# EasyEDA schematic SCH_PSG4-v0.52_2026-07-15.json

## Sheets
1 MCU_Port: TITLE: MCU_Port; REV: 1.0; Date: 2026-07-02; Sheet: 1/1; Drawn By: Denjhang; Company: Your Company
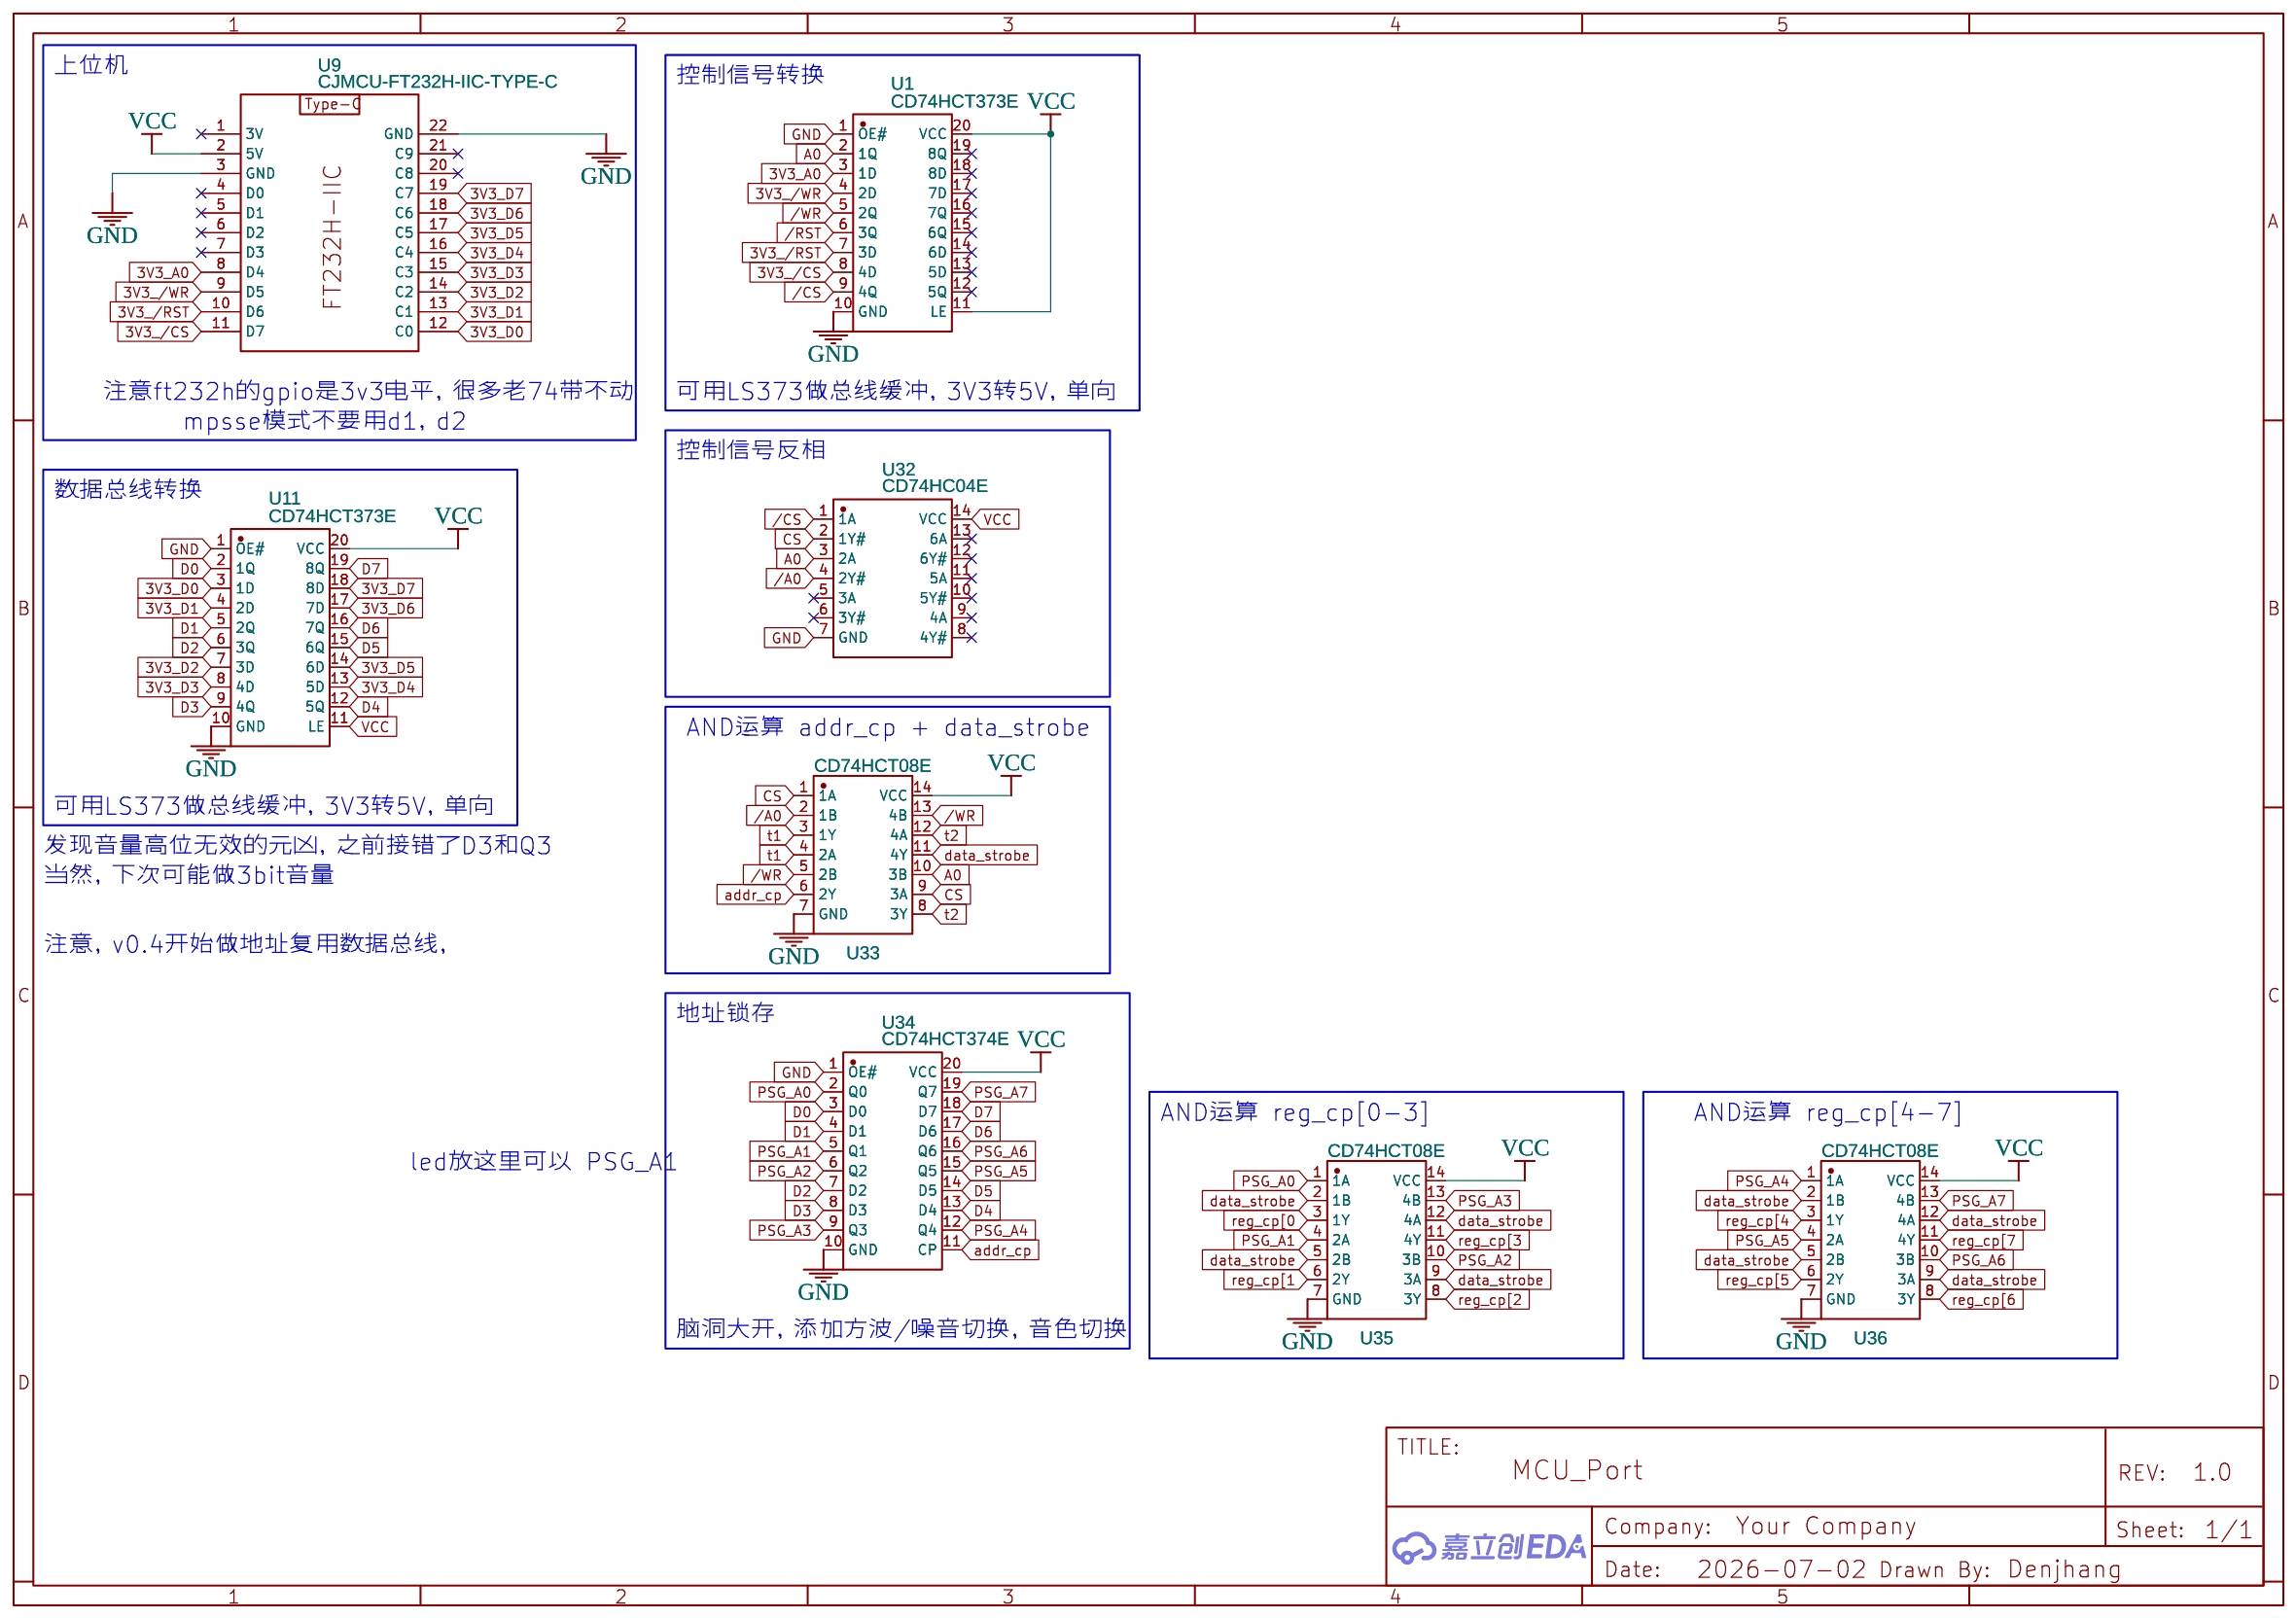
[diagram p0: MCU_Port]
2 Port_ADDR: TITLE: Port_ADDR; Date: 2026-07-09
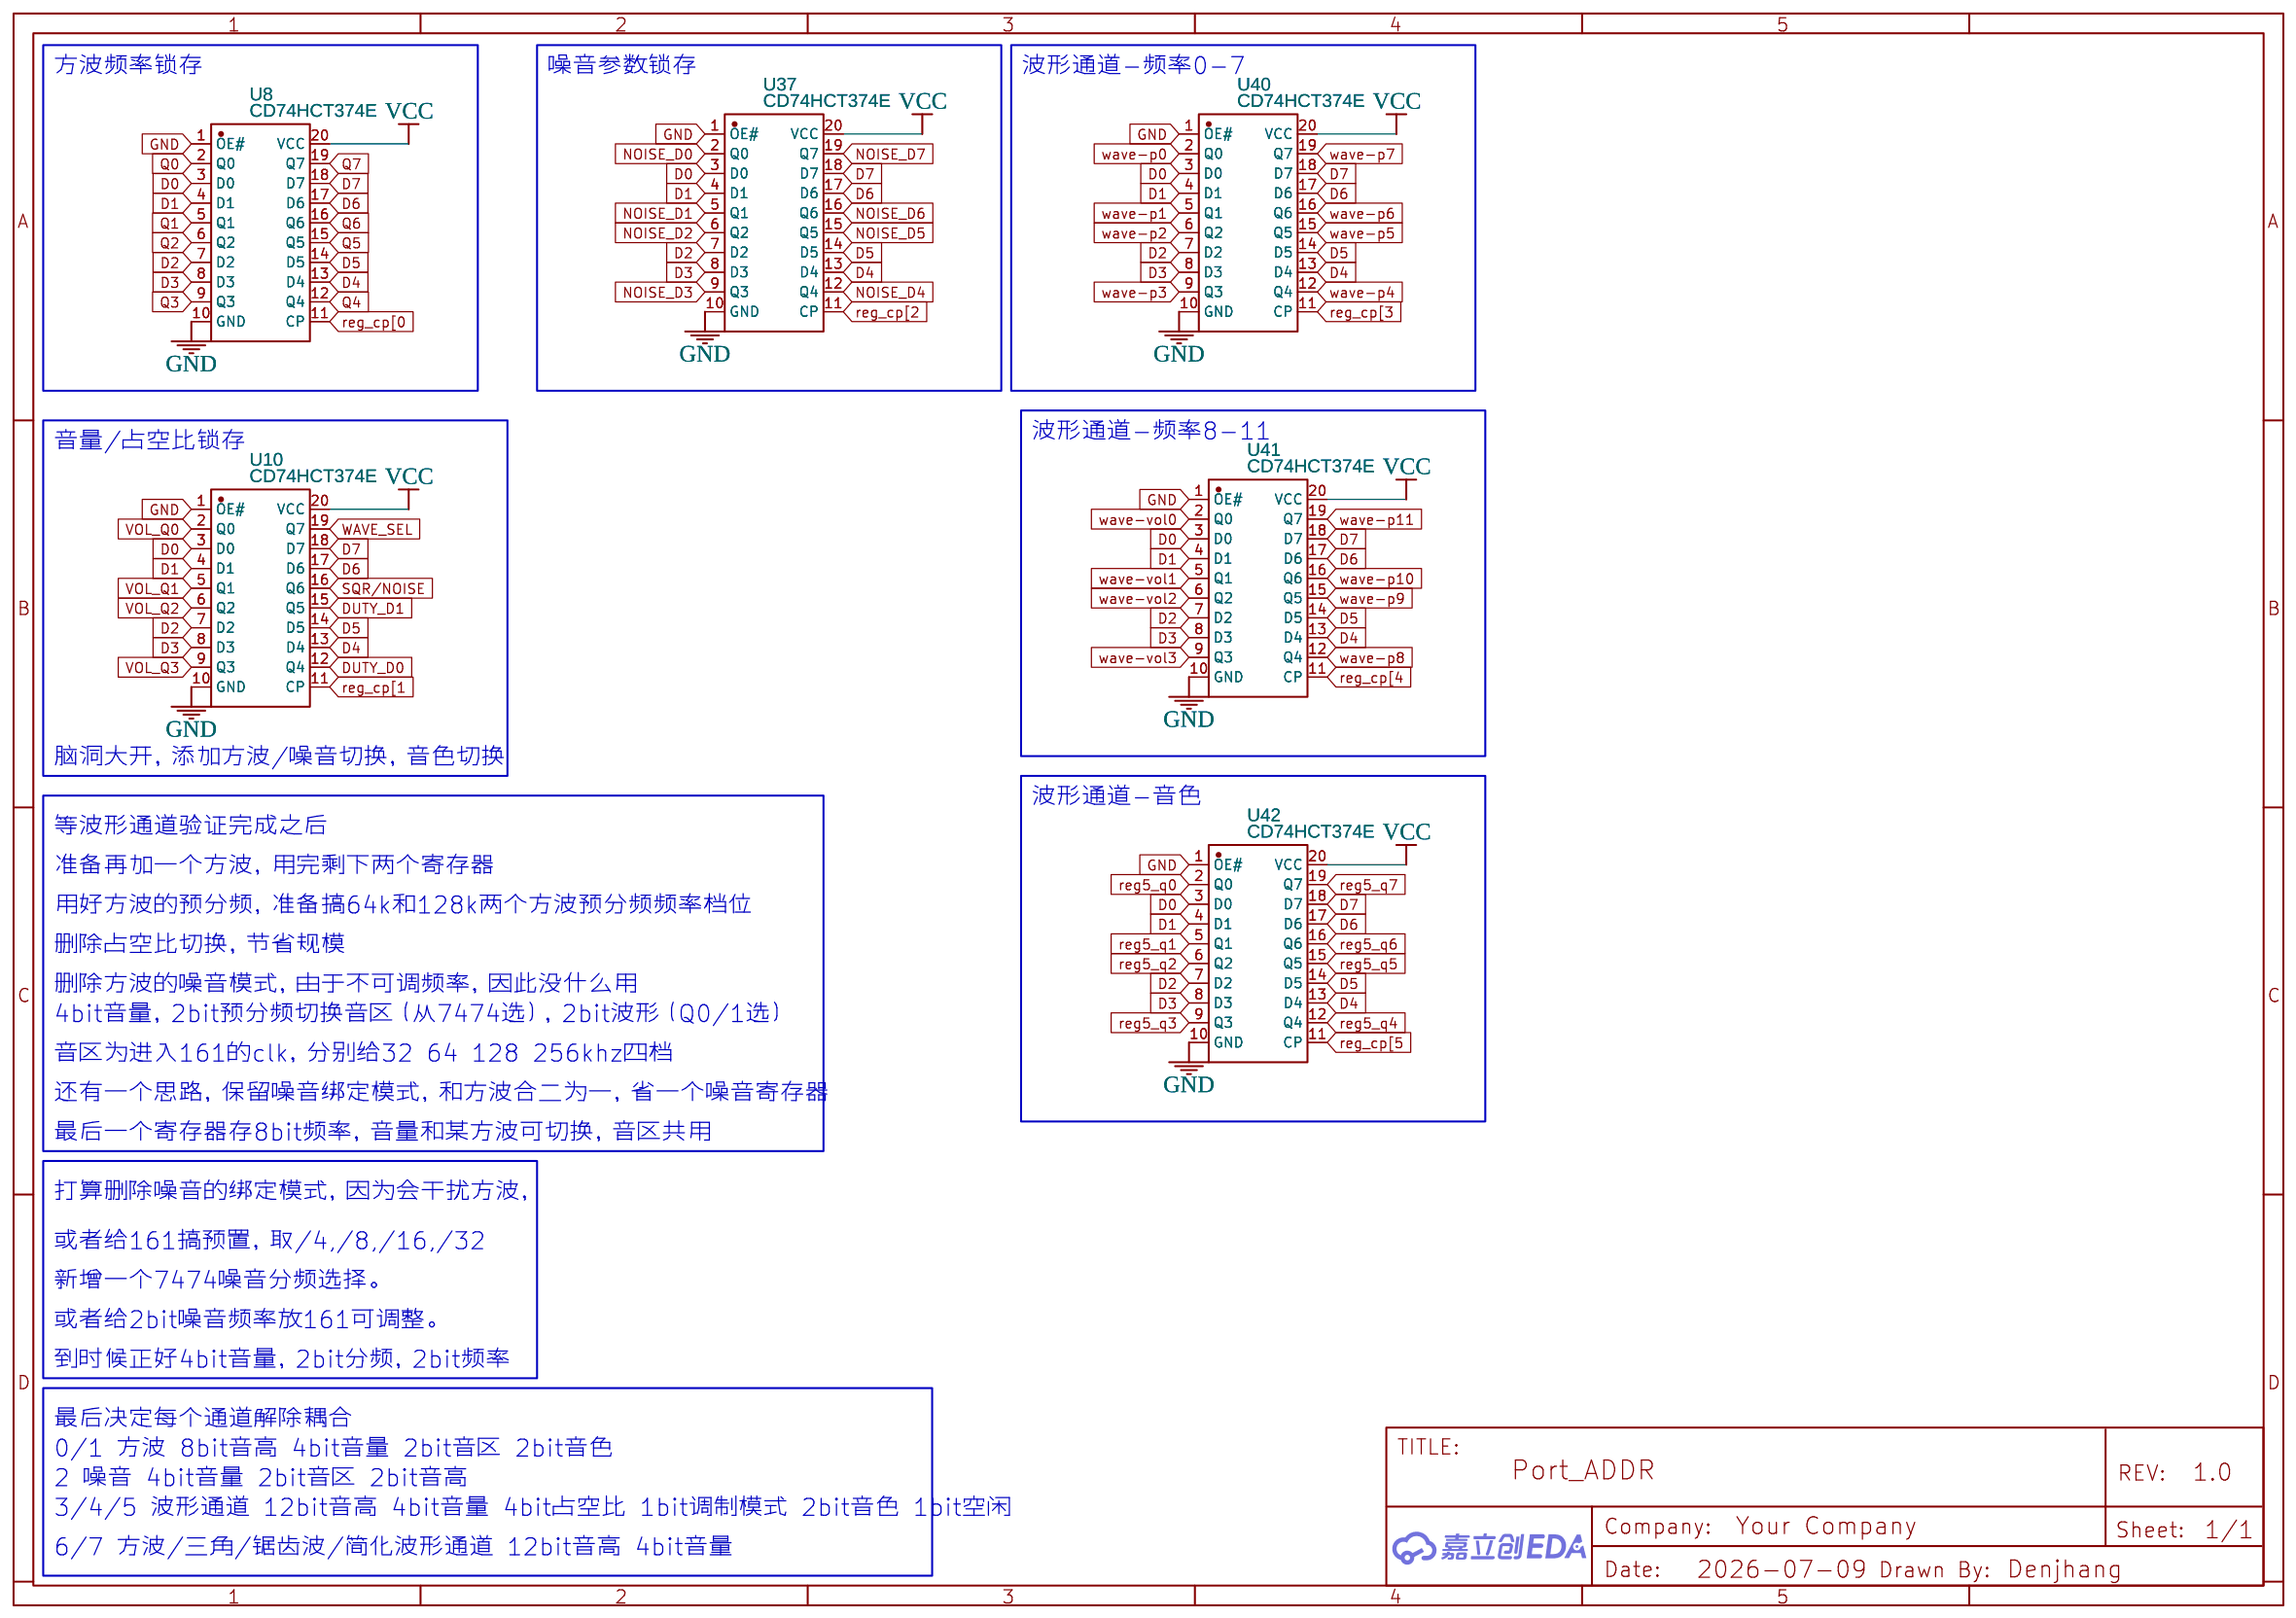
[diagram p1: Port_ADDR]
3 SQ_Ferq: TITLE: SQ_Freq; Date: 2026-06-30
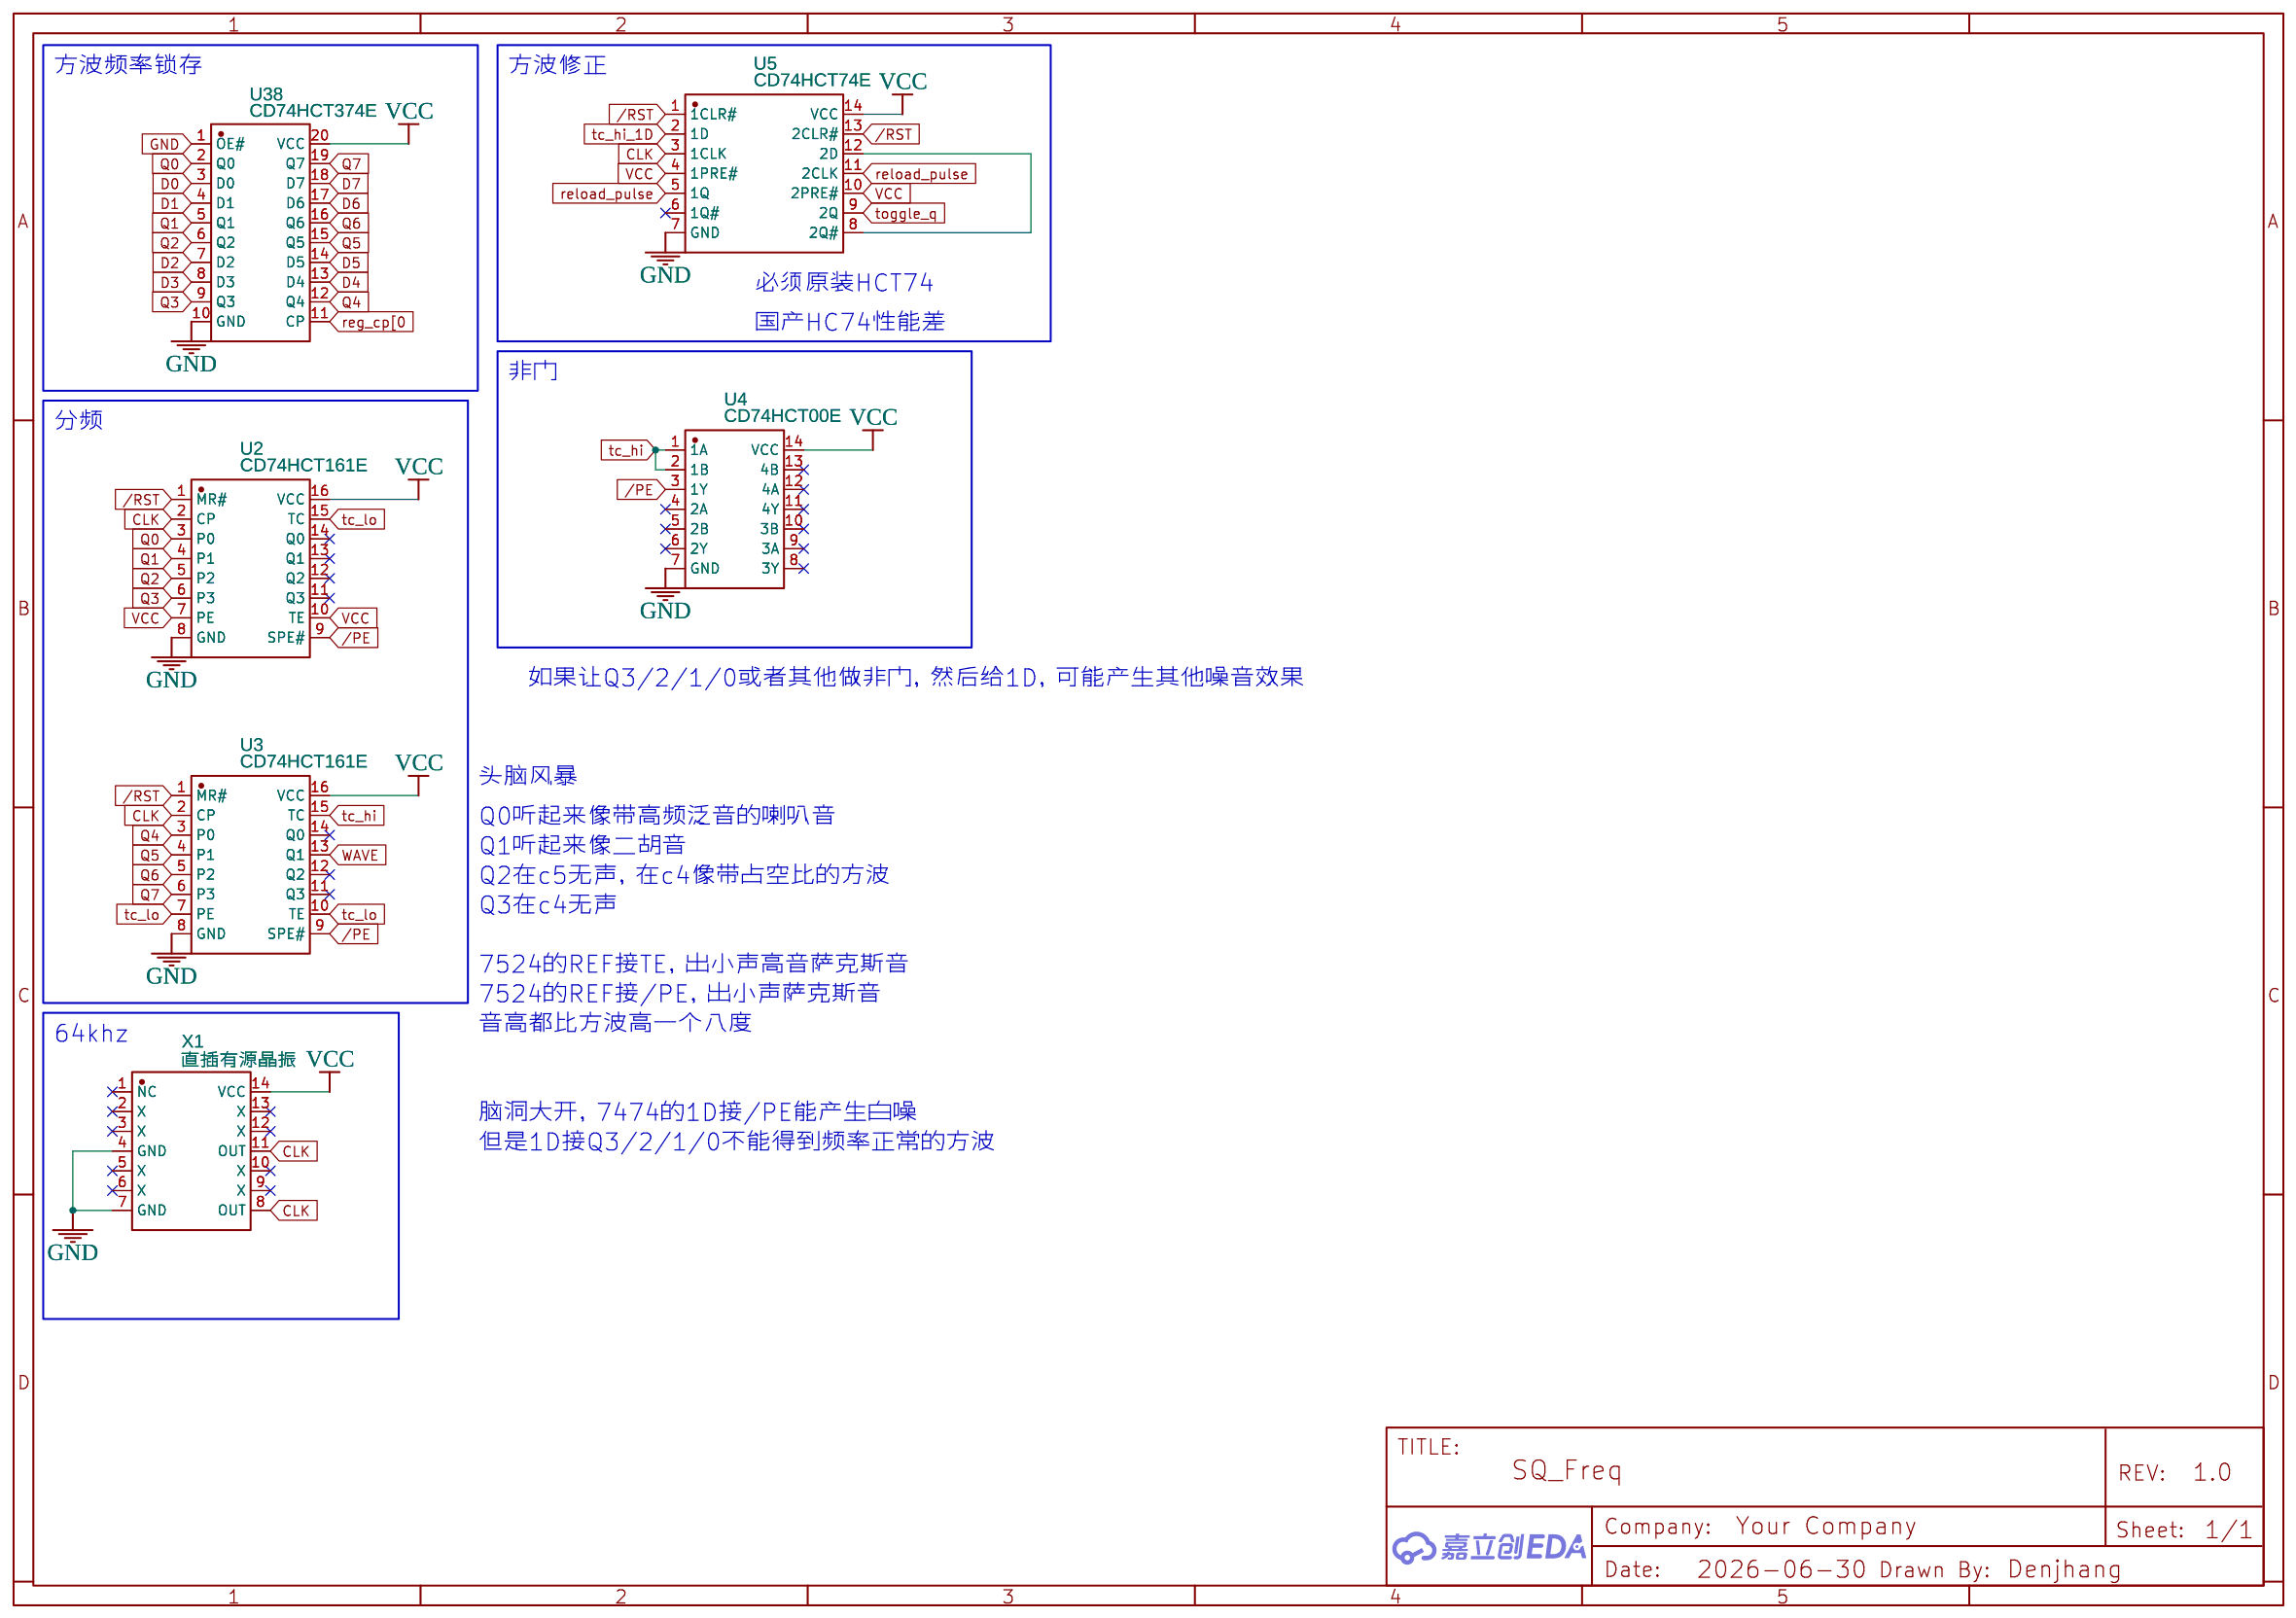
[diagram p2: SQ_Ferq]
4 SQ_Voice: TITLE: SQ_Voice
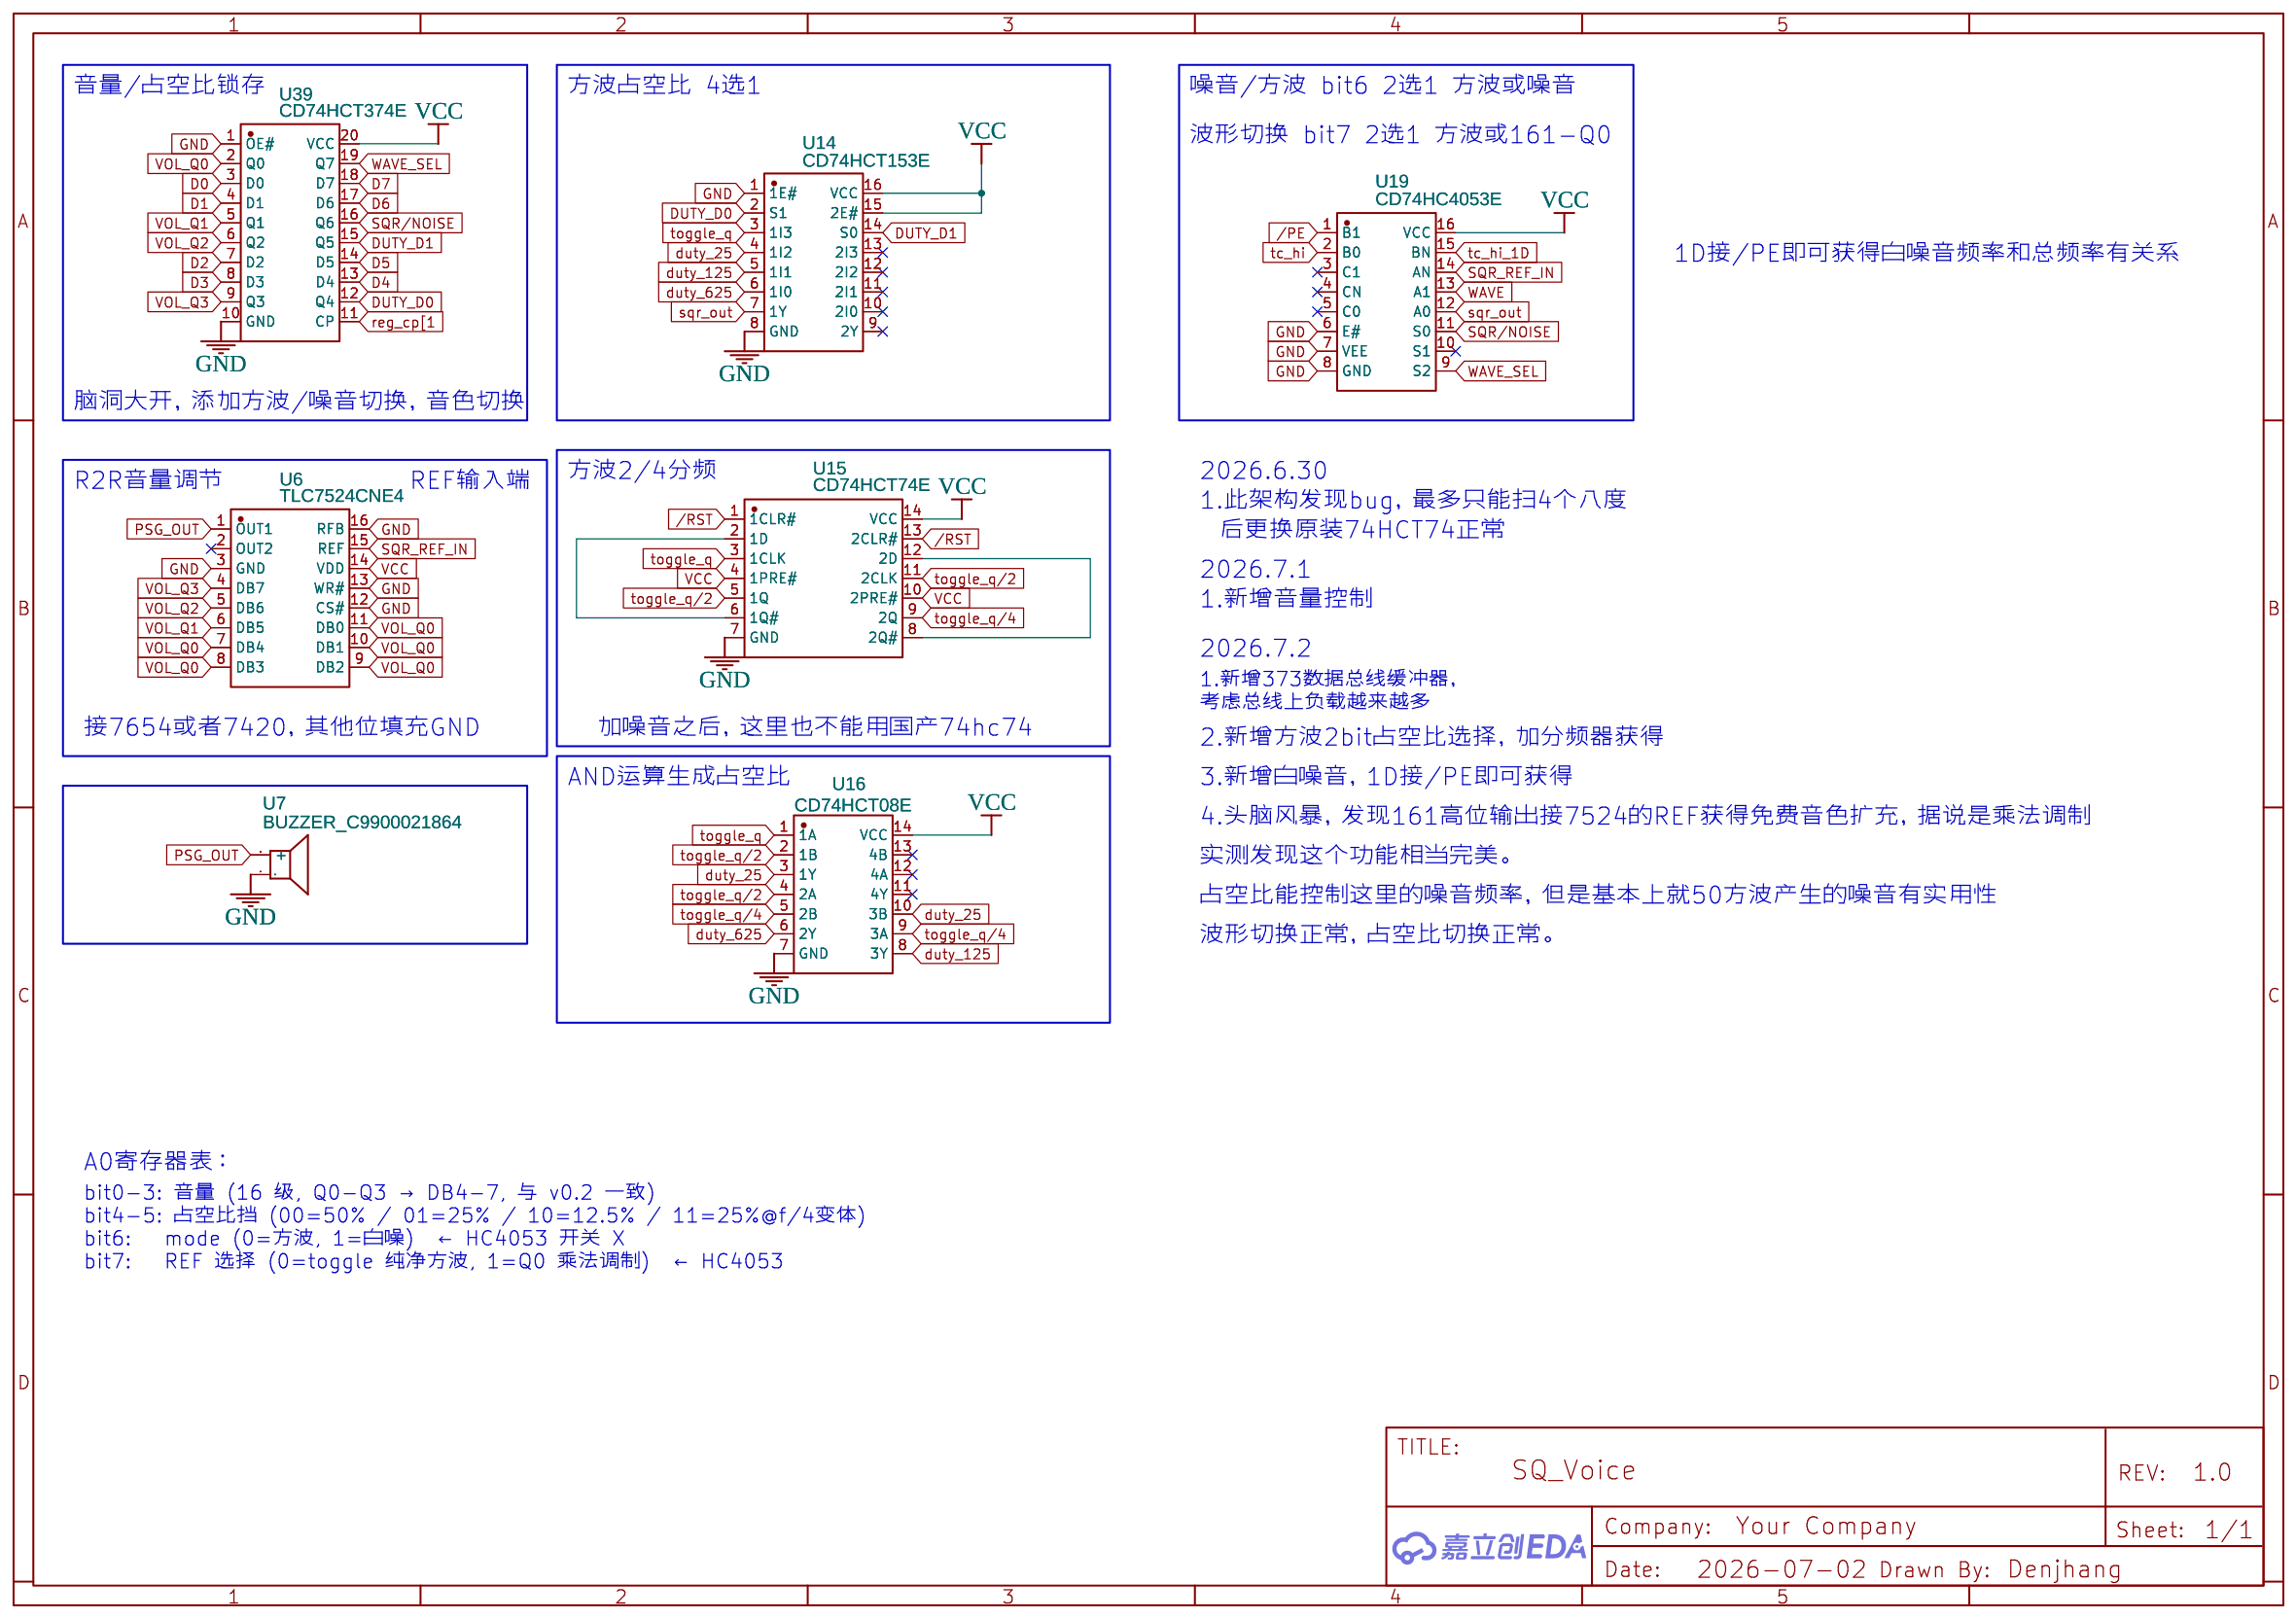
[diagram p3: SQ_Voice]
5 Noise: TITLE: NOISE1
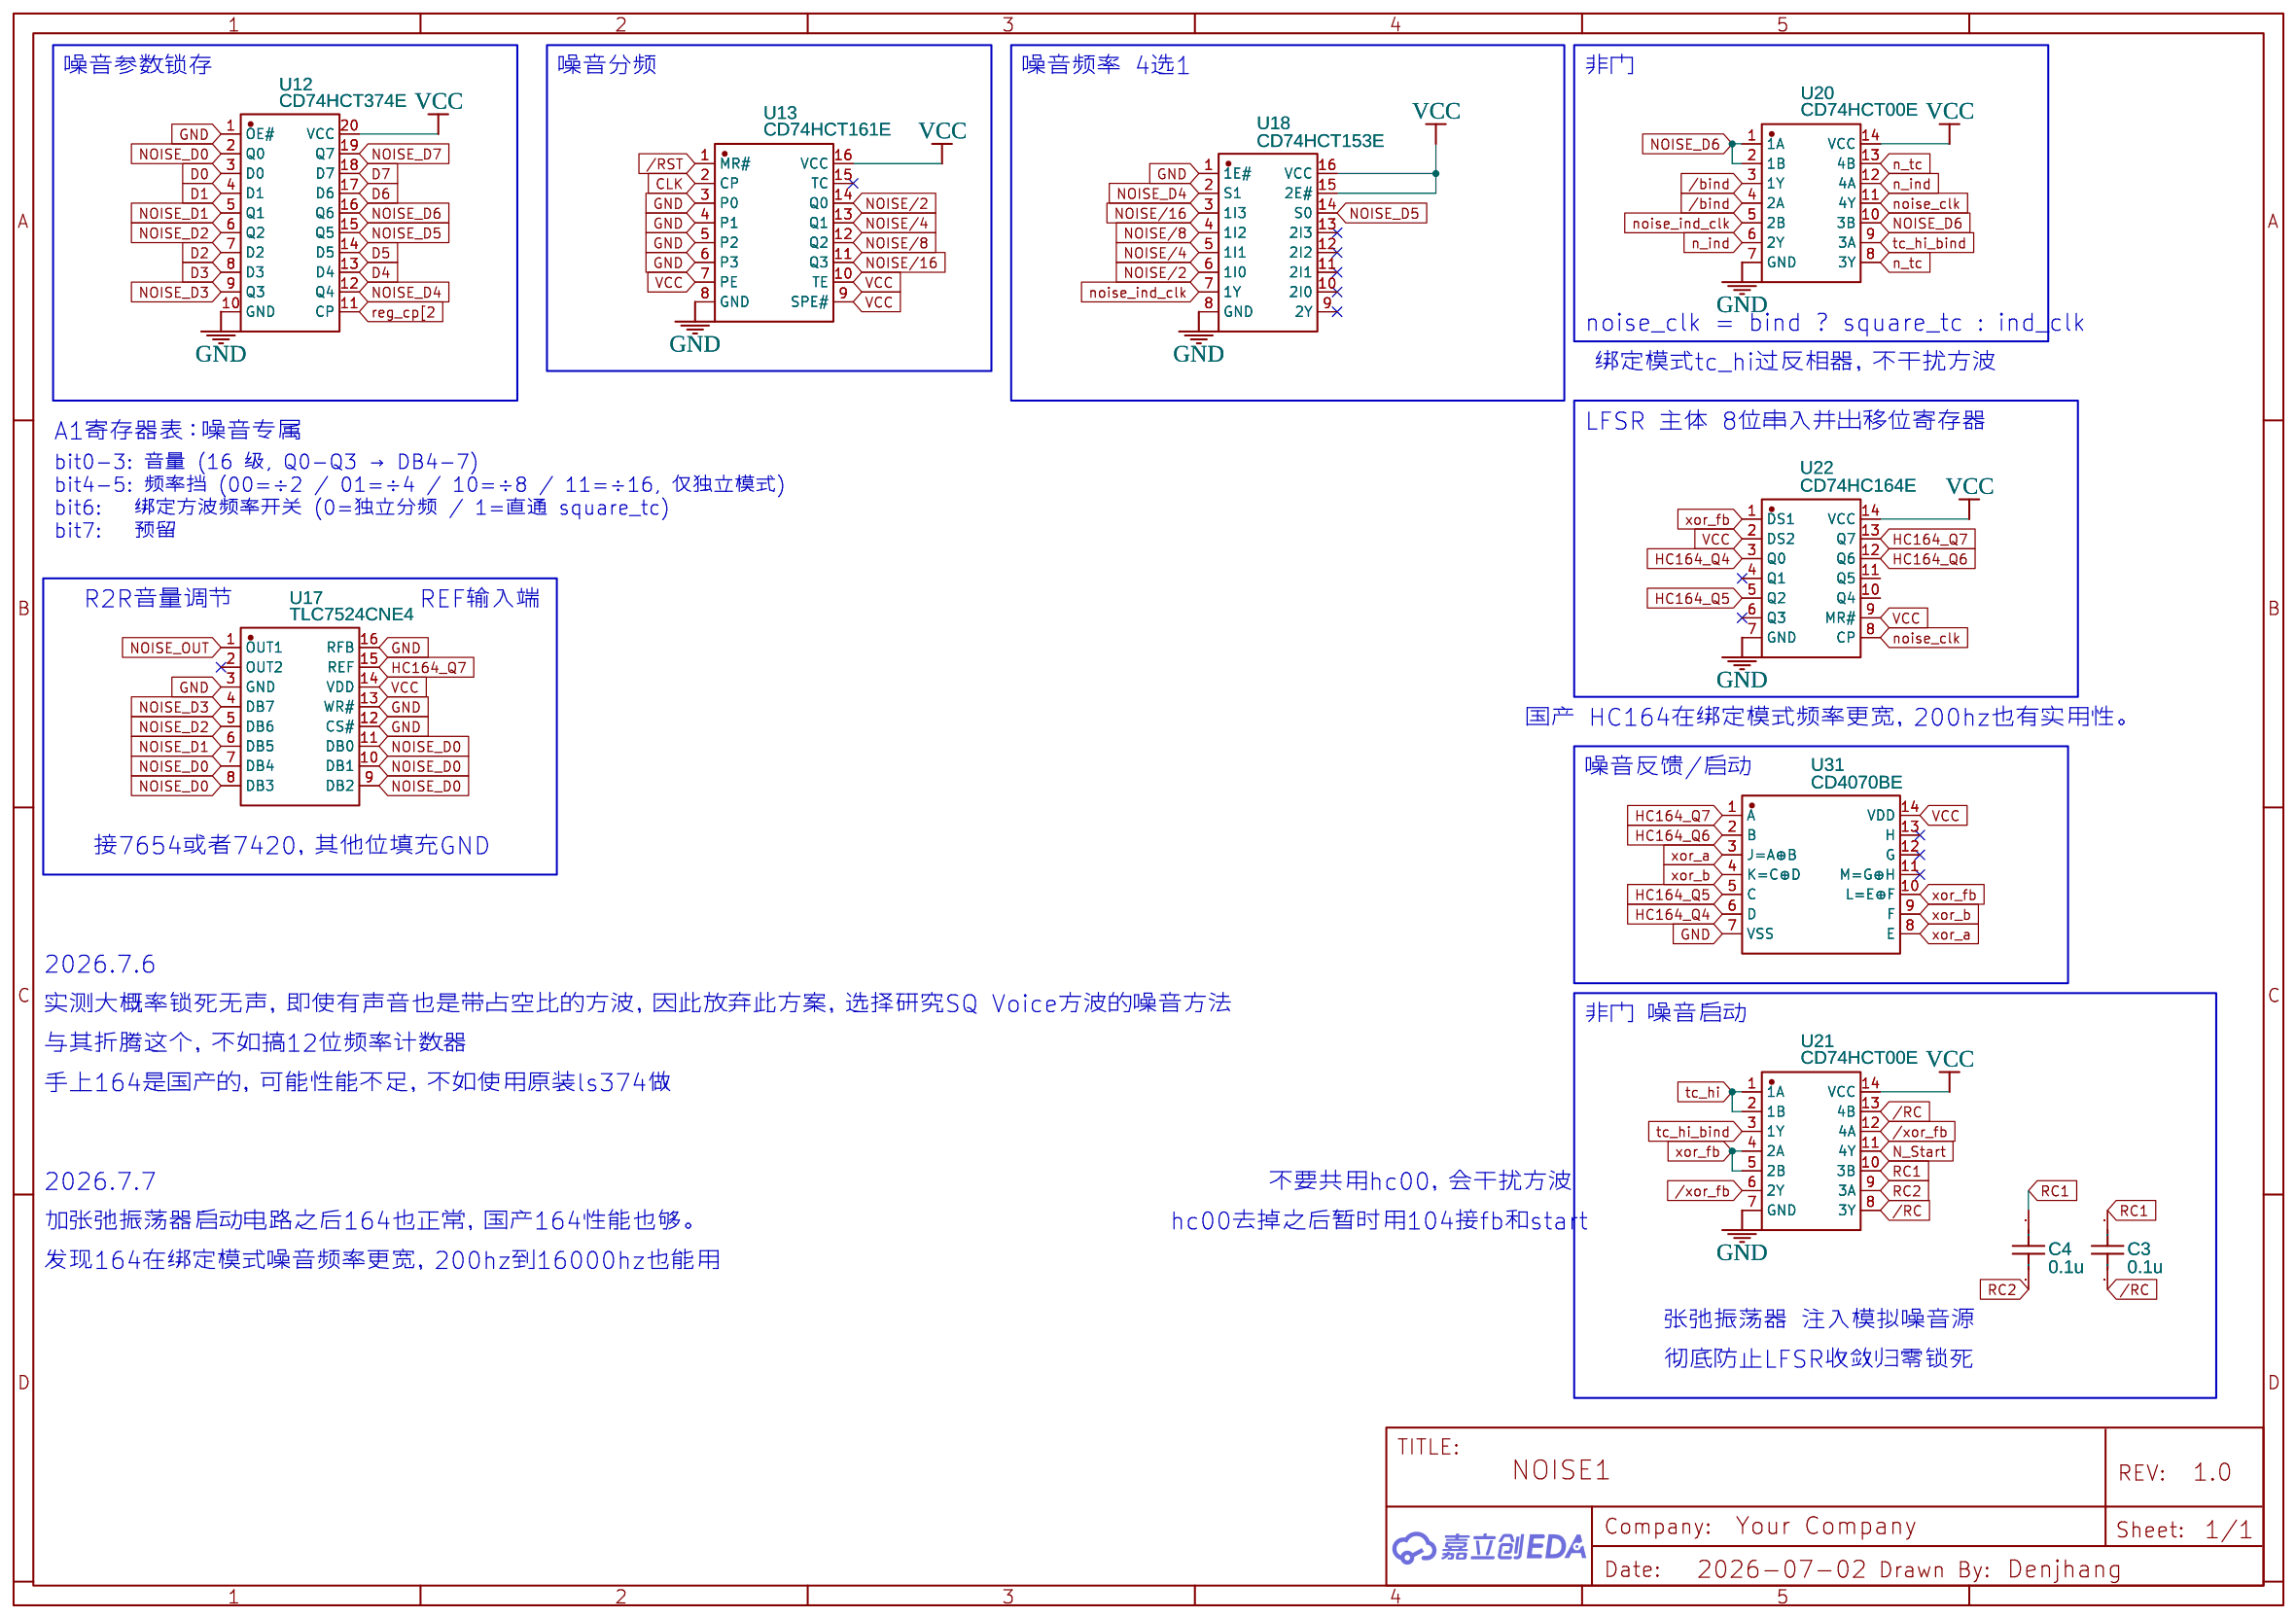
[diagram p4: Noise]
6 Wave_Freq: TITLE: Wave_Freq; Date: 2026-07-10
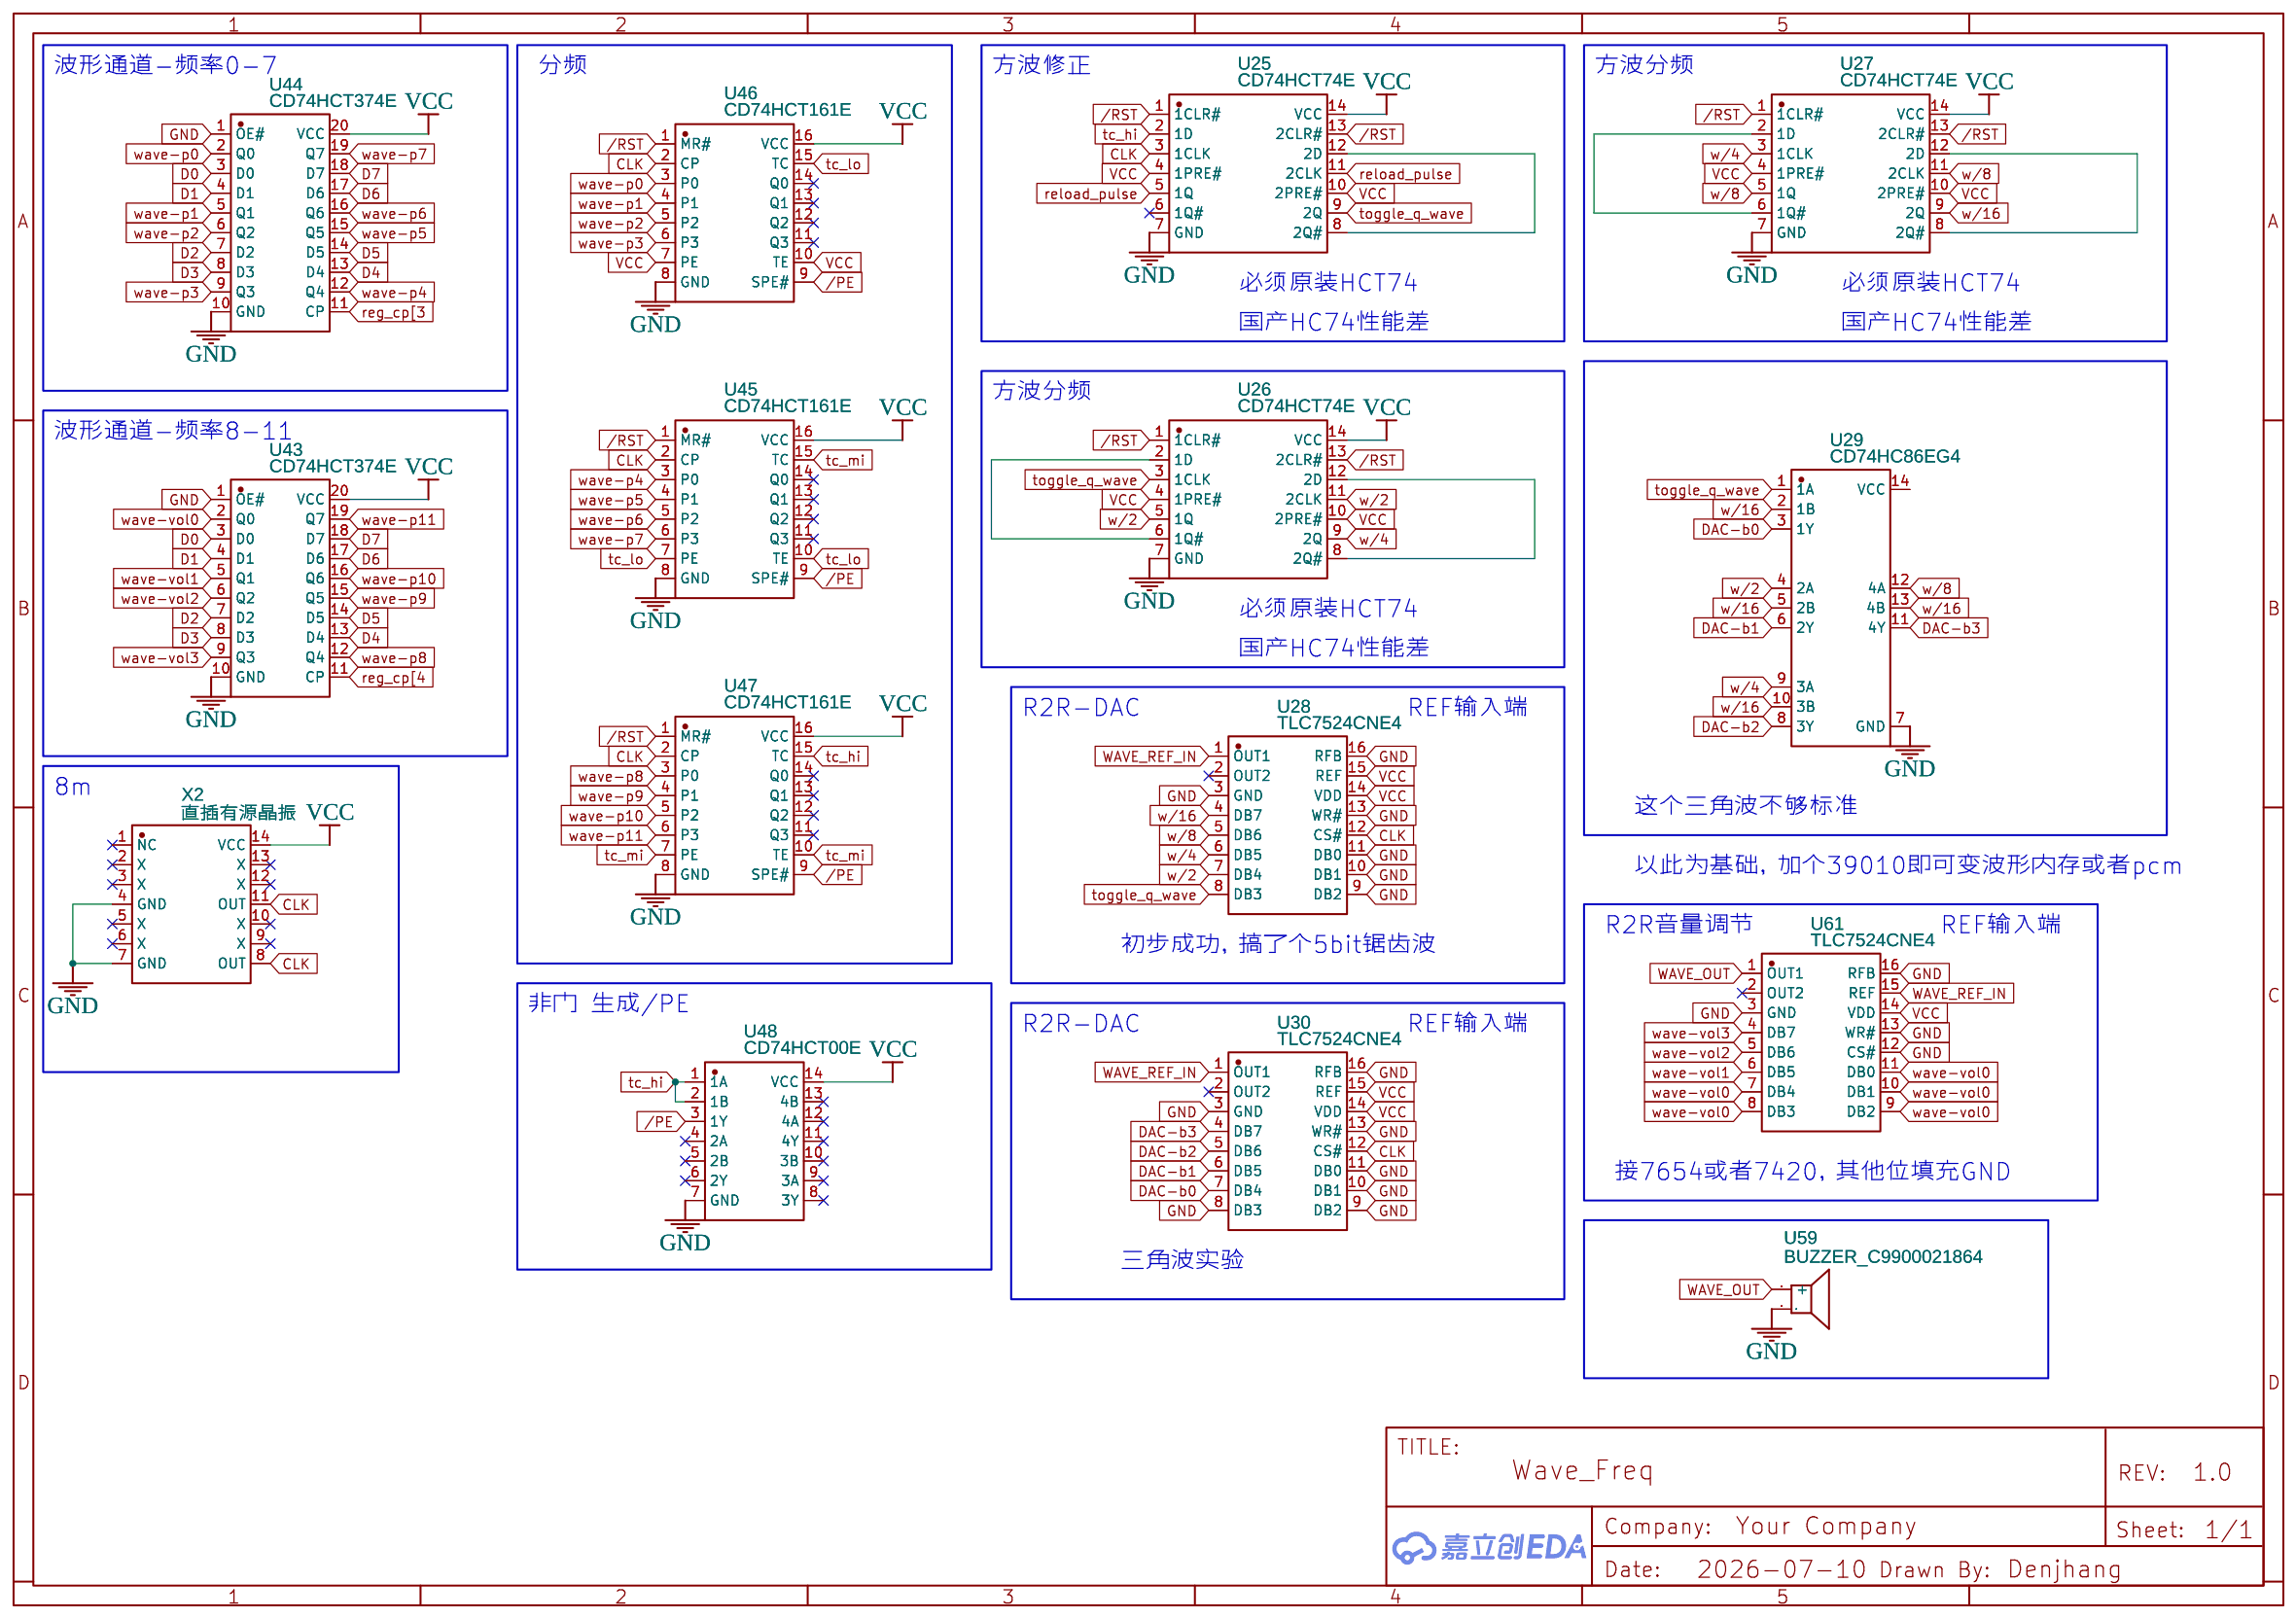
[diagram p5: Wave_Freq]
7 rev.d_WSG: TITLE: rev.d_WSG; Date: 2026-07-14
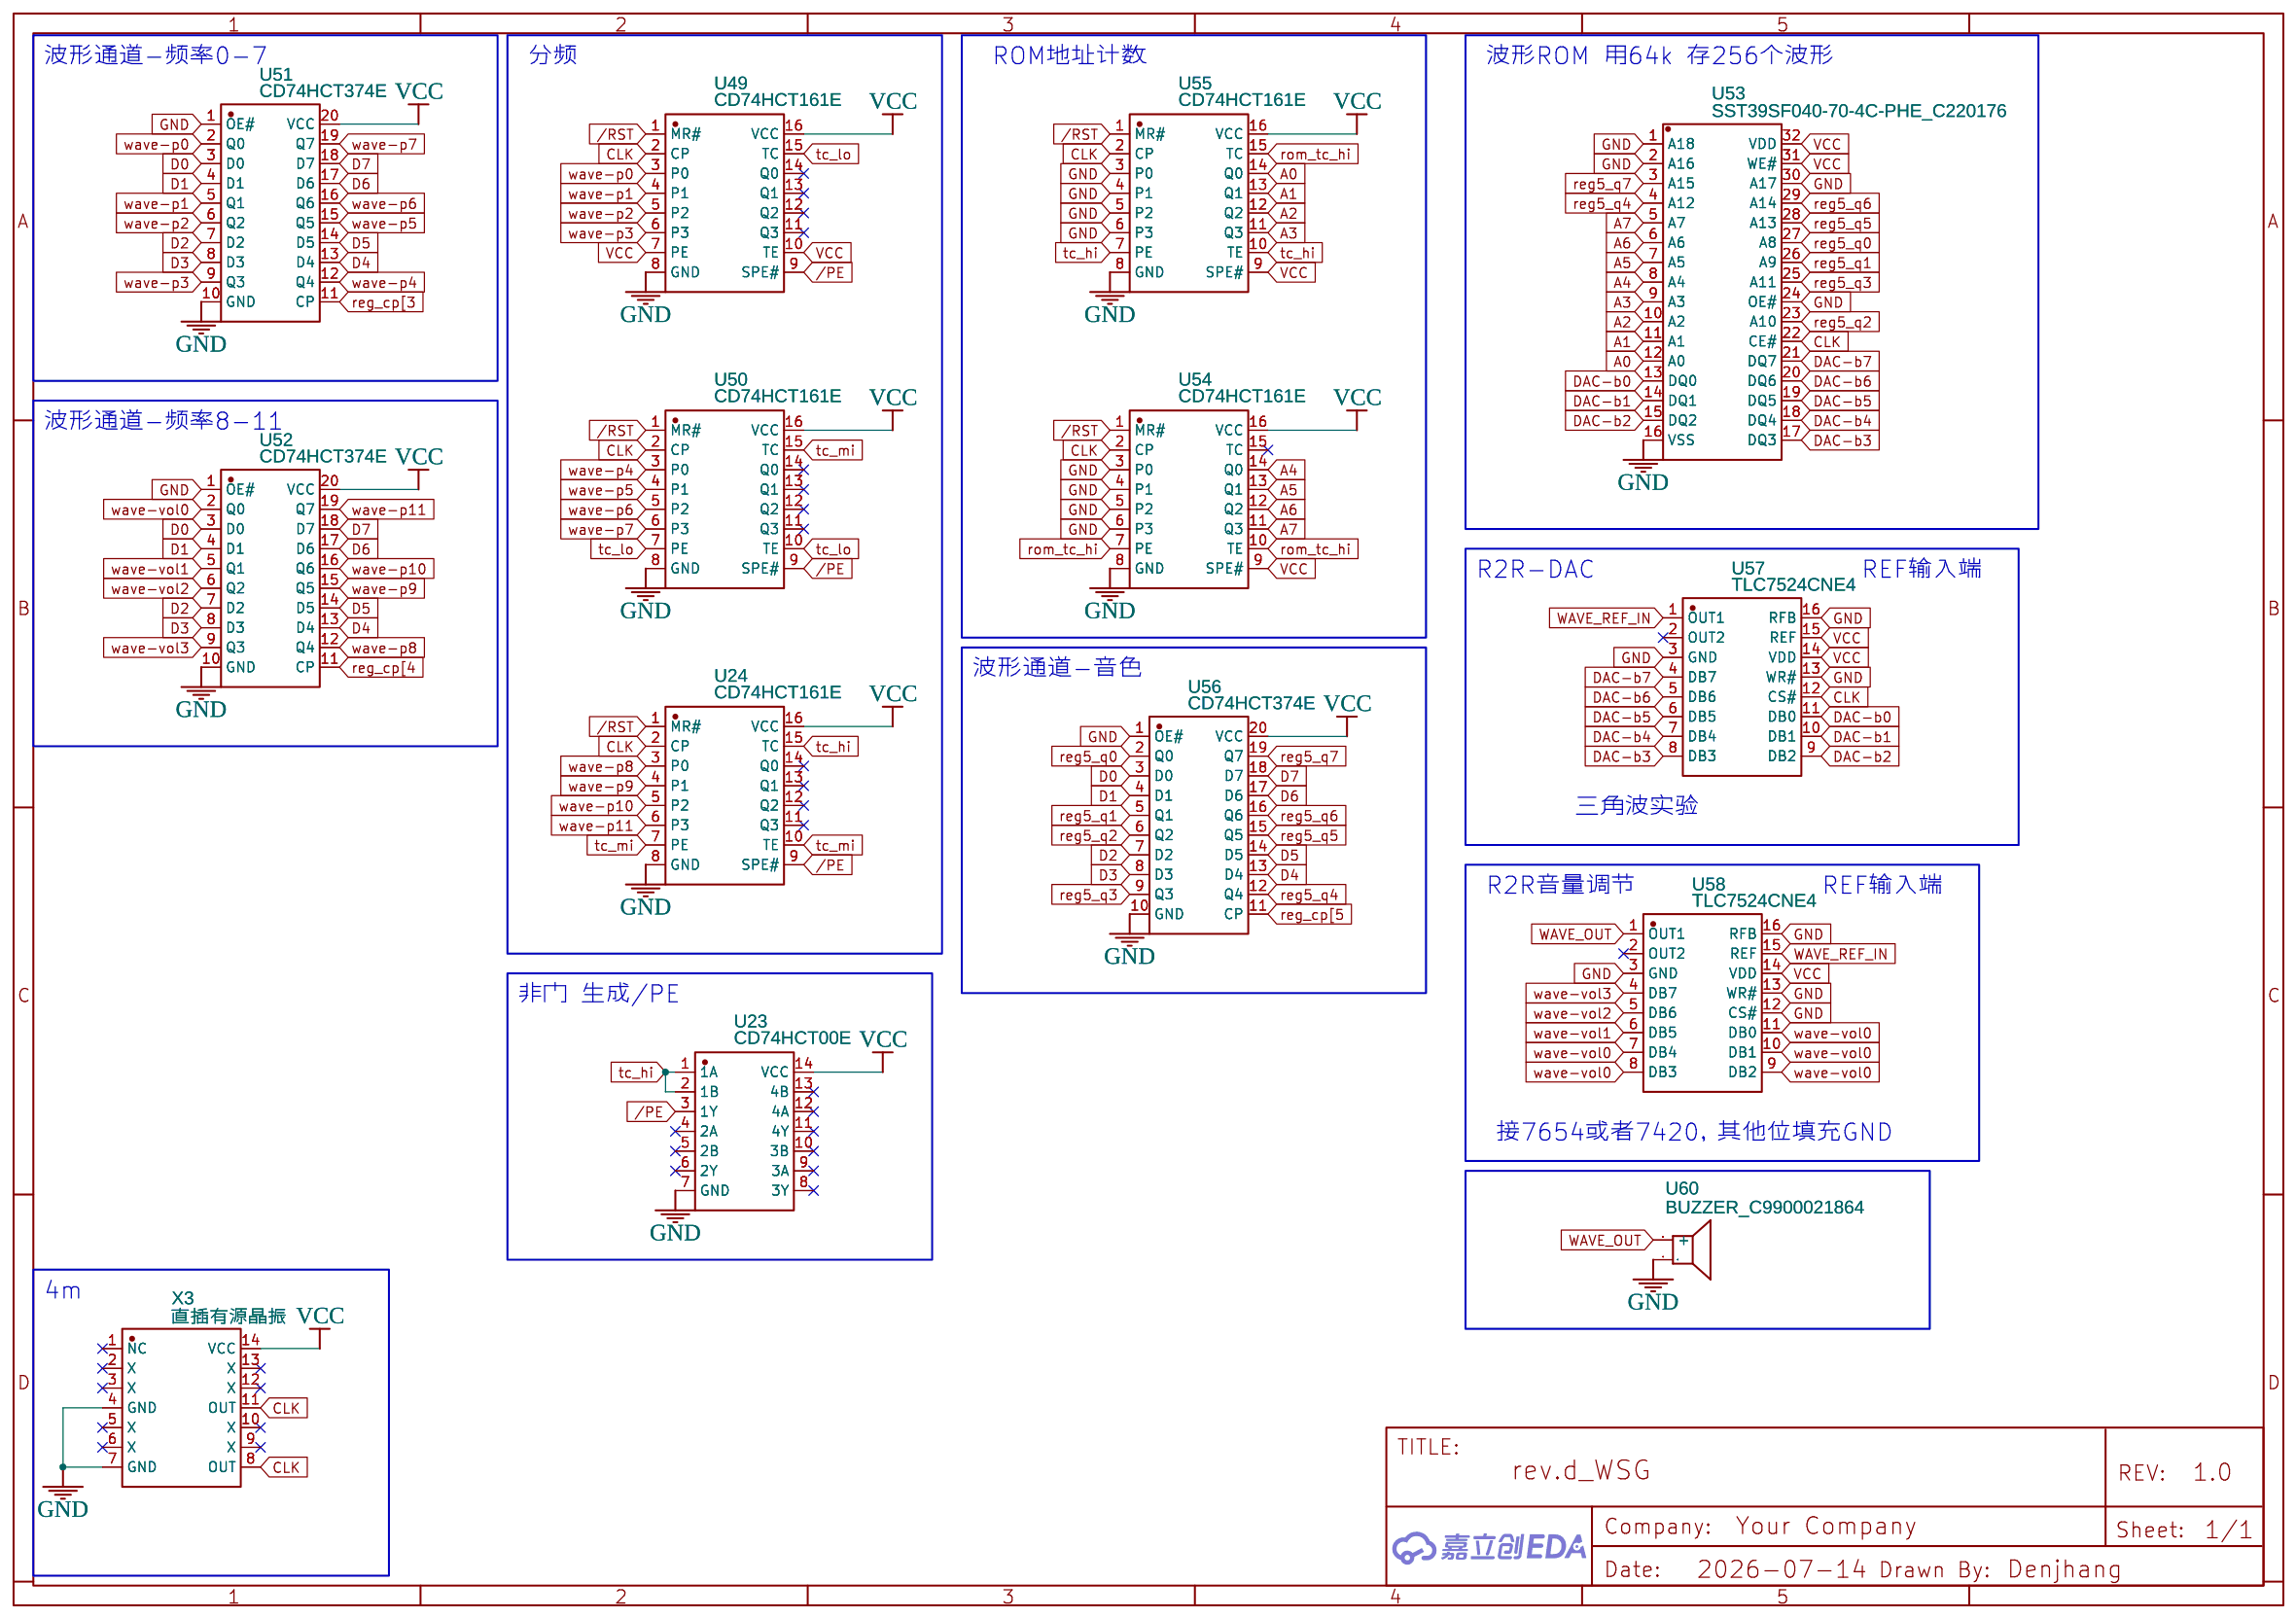
[diagram p6: rev.d_WSG]
8 rev.e PCM: TITLE: rev.e PCM; Date: 2026-07-14
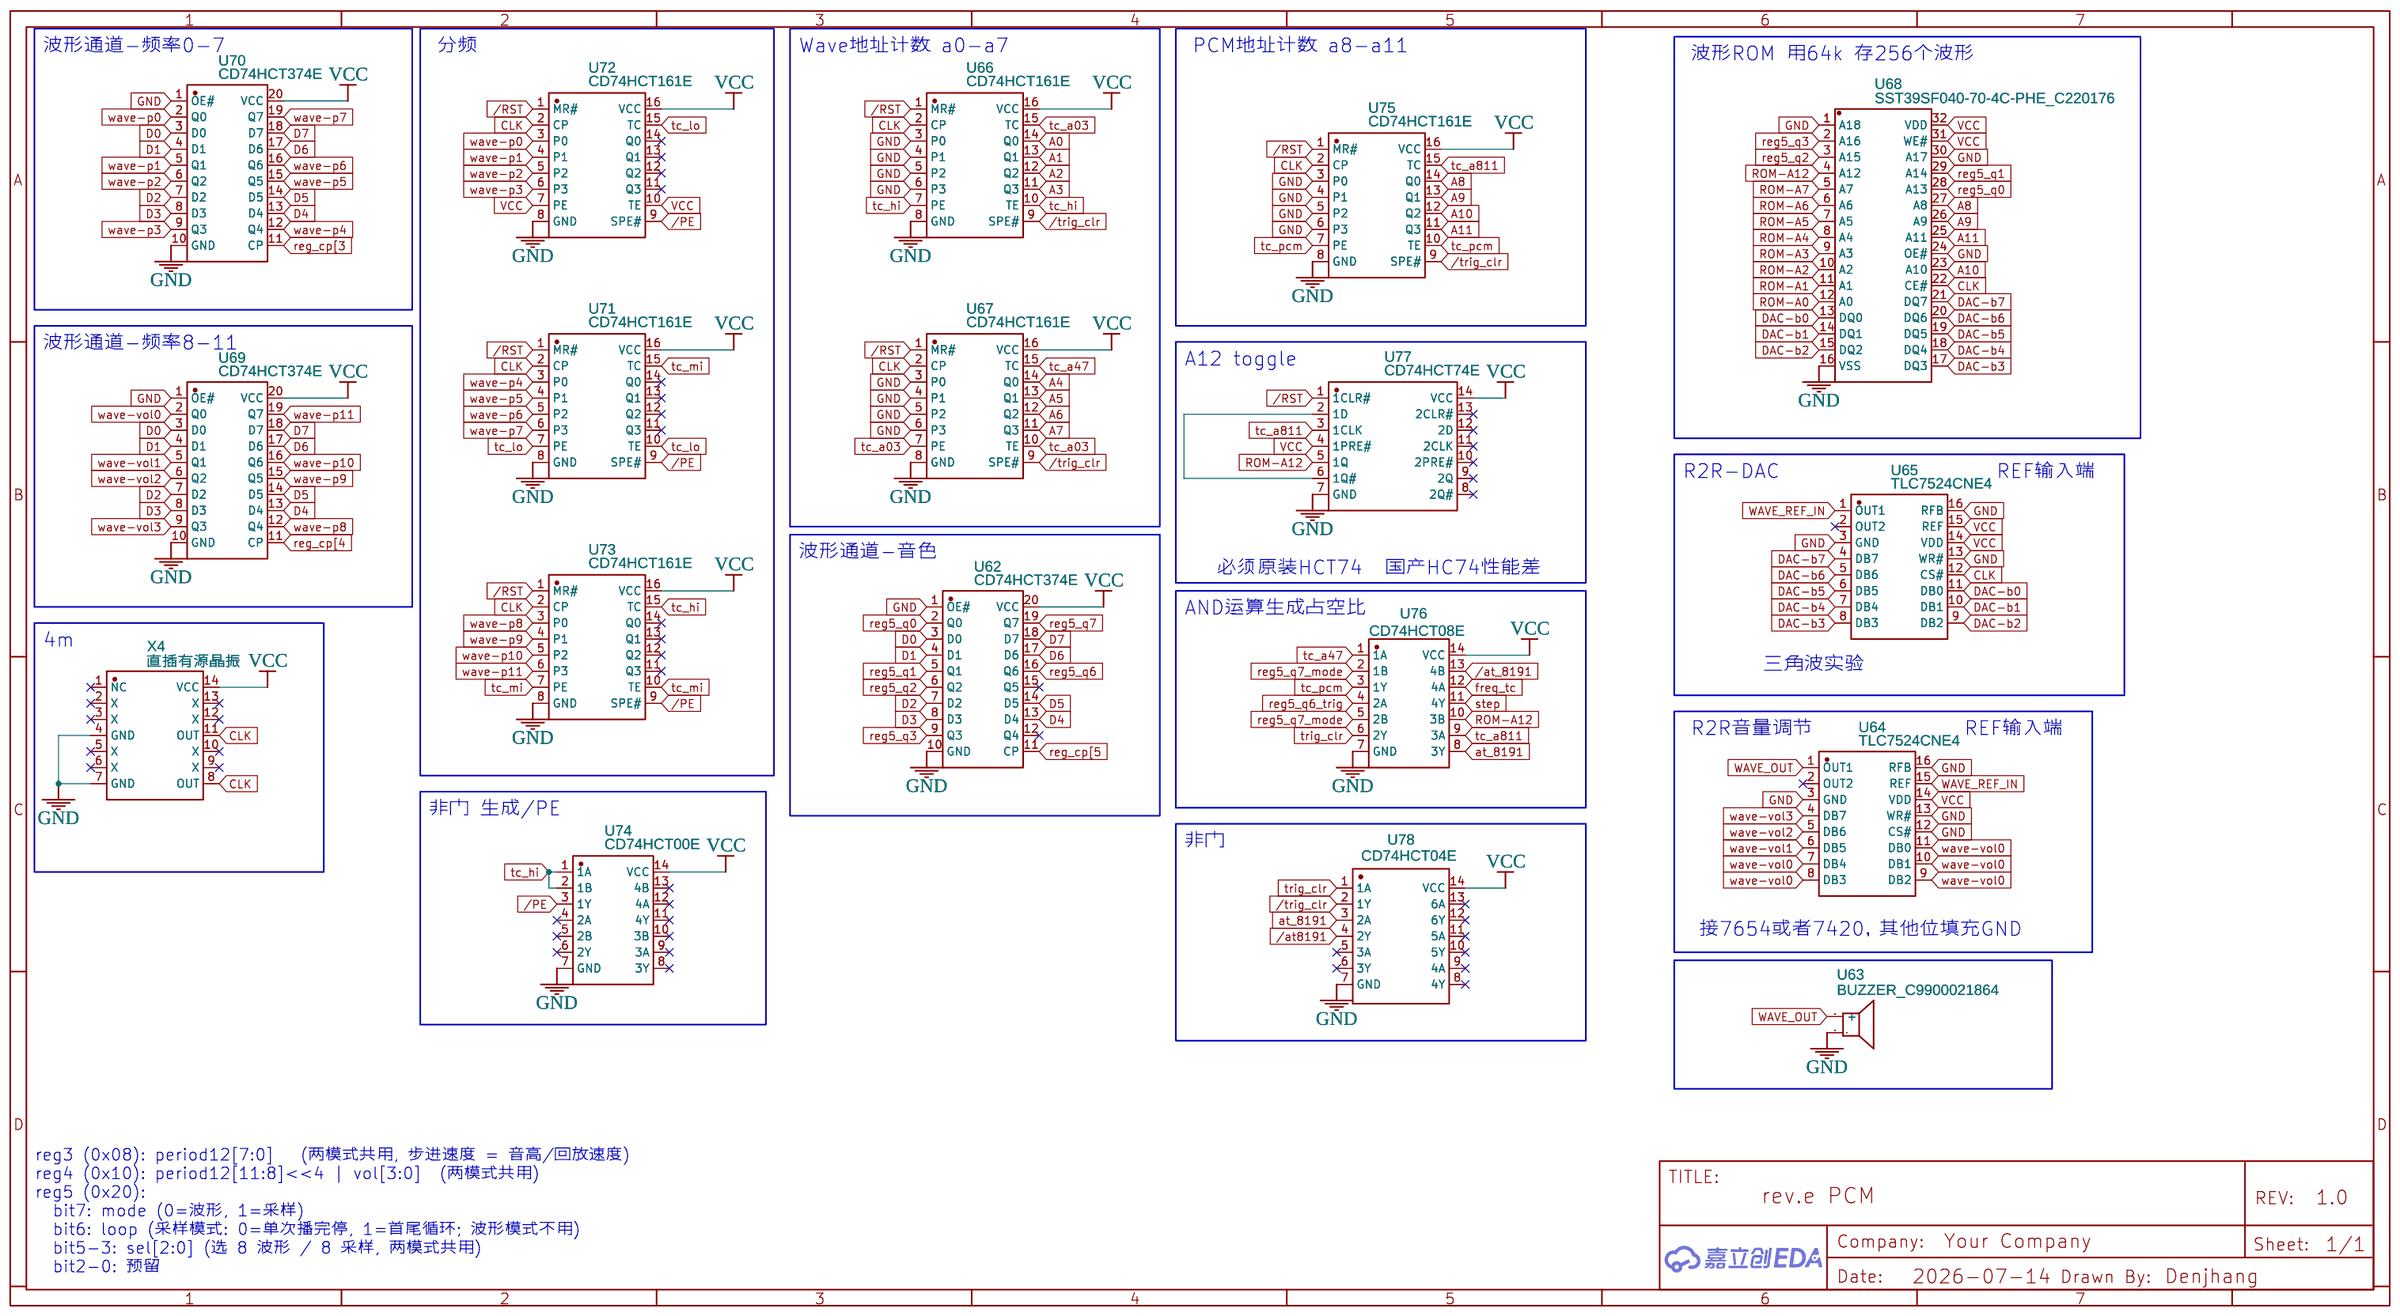
[diagram p7: rev.e PCM]

## Parts
sheet MCU_Port
U1  CD74HCT373E  [PDIP-20_L27.0-W6.5-P2.54-LS7.8-BL]
U9  CJMCU-FT232H-IIC-TYPE-C  [CJMCU-FT232H-IIC-TYPE-C]
U11  CD74HCT373E  [PDIP-20_L27.0-W6.5-P2.54-LS7.8-BL]
U32  CD74HC04E  [PDIP-14_L19.7-W6.6-P2.54-LS8.3-BL]
U33  CD74HCT08E  [PDIP-14_L19.7-W6.6-P2.54-LS8.3-BL]
U34  CD74HCT374E  [PDIP-20_L25.4-W6.4-P2.54-LS7.6-BL]
U35  CD74HCT08E  [PDIP-14_L19.7-W6.6-P2.54-LS8.3-BL]
U36  CD74HCT08E  [PDIP-14_L19.7-W6.6-P2.54-LS8.3-BL]
sheet Noise
C3  0.1u  [C0603]
C4  0.1u  [C0603]
U12  CD74HCT374E  [PDIP-20_L25.4-W6.4-P2.54-LS7.6-BL]
U13  CD74HCT161E  [PDIP-16_L19.3-W6.4-P2.54-LS7.94-BL]
U17  TLC7524CNE4  [PDIP-16_L19.3-W6.5-P2.54-LS7.6-BL]
U18  CD74HCT153E  [PDIP-16_L19.3-W6.4-P2.54-LS7.94-BL]
U20  CD74HCT00E  [PDIP-14_L19.3-W6.4-P2.54-LS8.0-BL]
U21  CD74HCT00E  [PDIP-14_L19.3-W6.4-P2.54-LS8.0-BL]
U22  CD74HC164E  [PDIP-14_L19.3-W6.4-P2.54-LS7.9-BL-1]
U31  CD4070BE  [PDIP-14_L19.3-W6.4-P2.54-LS7.6-BL]
sheet Port_ADDR
U8  CD74HCT374E  [PDIP-20_L25.4-W6.4-P2.54-LS7.6-BL]
U10  CD74HCT374E  [PDIP-20_L25.4-W6.4-P2.54-LS7.6-BL]
U37  CD74HCT374E  [PDIP-20_L25.4-W6.4-P2.54-LS7.6-BL]
U40  CD74HCT374E  [PDIP-20_L25.4-W6.4-P2.54-LS7.6-BL]
U41  CD74HCT374E  [PDIP-20_L25.4-W6.4-P2.54-LS7.6-BL]
U42  CD74HCT374E  [PDIP-20_L25.4-W6.4-P2.54-LS7.6-BL]
sheet rev.d_WSG
U23  CD74HCT00E  [PDIP-14_L19.3-W6.4-P2.54-LS8.0-BL]
U24  CD74HCT161E  [PDIP-16_L19.3-W6.4-P2.54-LS7.94-BL]
U49  CD74HCT161E  [PDIP-16_L19.3-W6.4-P2.54-LS7.94-BL]
U50  CD74HCT161E  [PDIP-16_L19.3-W6.4-P2.54-LS7.94-BL]
U51  CD74HCT374E  [PDIP-20_L25.4-W6.4-P2.54-LS7.6-BL]
U52  CD74HCT374E  [PDIP-20_L25.4-W6.4-P2.54-LS7.6-BL]
U53  SST39SF040-70-4C-PHE_C220176  [PDIP-32_L42.0-W13.7-P2.54-LS15.2-BL]
U54  CD74HCT161E  [PDIP-16_L19.3-W6.4-P2.54-LS7.94-BL]
U55  CD74HCT161E  [PDIP-16_L19.3-W6.4-P2.54-LS7.94-BL]
U56  CD74HCT374E  [PDIP-20_L25.4-W6.4-P2.54-LS7.6-BL]
U57  TLC7524CNE4  [PDIP-16_L19.3-W6.5-P2.54-LS7.6-BL]
U58  TLC7524CNE4  [PDIP-16_L19.3-W6.5-P2.54-LS7.6-BL]
U60  BUZZER_C9900021864  [BUZ-SMD_BUZZER]
X3  直插有源晶振  [DIP14-有源晶振]
sheet rev.e PCM
U62  CD74HCT374E  [PDIP-20_L25.4-W6.4-P2.54-LS7.6-BL]
U63  BUZZER_C9900021864  [BUZ-SMD_BUZZER]
U64  TLC7524CNE4  [PDIP-16_L19.3-W6.5-P2.54-LS7.6-BL]
U65  TLC7524CNE4  [PDIP-16_L19.3-W6.5-P2.54-LS7.6-BL]
U66  CD74HCT161E  [PDIP-16_L19.3-W6.4-P2.54-LS7.94-BL]
U67  CD74HCT161E  [PDIP-16_L19.3-W6.4-P2.54-LS7.94-BL]
U68  SST39SF040-70-4C-PHE_C220176  [PDIP-32_L42.0-W13.7-P2.54-LS15.2-BL]
U69  CD74HCT374E  [PDIP-20_L25.4-W6.4-P2.54-LS7.6-BL]
U70  CD74HCT374E  [PDIP-20_L25.4-W6.4-P2.54-LS7.6-BL]
U71  CD74HCT161E  [PDIP-16_L19.3-W6.4-P2.54-LS7.94-BL]
U72  CD74HCT161E  [PDIP-16_L19.3-W6.4-P2.54-LS7.94-BL]
U73  CD74HCT161E  [PDIP-16_L19.3-W6.4-P2.54-LS7.94-BL]
U74  CD74HCT00E  [PDIP-14_L19.3-W6.4-P2.54-LS8.0-BL]
U75  CD74HCT161E  [PDIP-16_L19.3-W6.4-P2.54-LS7.94-BL]
U76  CD74HCT08E  [PDIP-14_L19.7-W6.6-P2.54-LS8.3-BL]
U77  CD74HCT74E  [PDIP-14_L19.7-W6.6-P2.54-LS8.3-BL]
U78  CD74HCT04E  [DIP14]
X4  直插有源晶振  [DIP14-有源晶振]
sheet SQ_Ferq
U2  CD74HCT161E  [PDIP-16_L19.3-W6.4-P2.54-LS7.94-BL]
U3  CD74HCT161E  [PDIP-16_L19.3-W6.4-P2.54-LS7.94-BL]
U4  CD74HCT00E  [PDIP-14_L19.3-W6.4-P2.54-LS8.0-BL]
U5  CD74HCT74E  [PDIP-14_L19.7-W6.6-P2.54-LS8.3-BL]
U38  CD74HCT374E  [PDIP-20_L25.4-W6.4-P2.54-LS7.6-BL]
X1  直插有源晶振  [DIP14-有源晶振]
sheet SQ_Voice
U6  TLC7524CNE4  [PDIP-16_L19.3-W6.5-P2.54-LS7.6-BL]
U7  BUZZER_C9900021864  [BUZ-SMD_BUZZER]
U14  CD74HCT153E  [PDIP-16_L19.3-W6.4-P2.54-LS7.94-BL]
U15  CD74HCT74E  [PDIP-14_L19.7-W6.6-P2.54-LS8.3-BL]
U16  CD74HCT08E  [PDIP-14_L19.7-W6.6-P2.54-LS8.3-BL]
U19  CD74HC4053E  [DIP-16_L19.8-W6.5-P2.54-LS7.6-BL]
U39  CD74HCT374E  [PDIP-20_L25.4-W6.4-P2.54-LS7.6-BL]
sheet Wave_Freq
U25  CD74HCT74E  [PDIP-14_L19.7-W6.6-P2.54-LS8.3-BL]
U26  CD74HCT74E  [PDIP-14_L19.7-W6.6-P2.54-LS8.3-BL]
U27  CD74HCT74E  [PDIP-14_L19.7-W6.6-P2.54-LS8.3-BL]
U28  TLC7524CNE4  [PDIP-16_L19.3-W6.5-P2.54-LS7.6-BL]
U29  CD74HC86EG4  [PDIP-14_L19.3-W6.5-P2.54-LS7.6-BL]
U30  TLC7524CNE4  [PDIP-16_L19.3-W6.5-P2.54-LS7.6-BL]
U43  CD74HCT374E  [PDIP-20_L25.4-W6.4-P2.54-LS7.6-BL]
U44  CD74HCT374E  [PDIP-20_L25.4-W6.4-P2.54-LS7.6-BL]
U45  CD74HCT161E  [PDIP-16_L19.3-W6.4-P2.54-LS7.94-BL]
U46  CD74HCT161E  [PDIP-16_L19.3-W6.4-P2.54-LS7.94-BL]
U47  CD74HCT161E  [PDIP-16_L19.3-W6.4-P2.54-LS7.94-BL]
U48  CD74HCT00E  [PDIP-14_L19.3-W6.4-P2.54-LS8.0-BL]
U59  BUZZER_C9900021864  [BUZ-SMD_BUZZER]
U61  TLC7524CNE4  [PDIP-16_L19.3-W6.5-P2.54-LS7.6-BL]
X2  直插有源晶振  [DIP14-有源晶振]

## Library data of the parts
U1 U11 = CD74HCT373E: Contributor: LCSC; Supplier: LCSC; Supplier Part: C1547801; Manufacturer: TI(德州仪器); JLCPCB Part Class: Extended Part
U9 = CJMCU-FT232H-IIC-TYPE-C: Contributor: bloodeatergod
U32 = CD74HC04E: Contributor: LCSC; Supplier: LCSC; Supplier Part: C90839; Manufacturer: TI(德州仪器); JLCPCB Part Class: Extended Part
U16 U33 U35 U36 U76 = CD74HCT08E: Contributor: LCSC; Supplier: LCSC; Supplier Part: C553165; Manufacturer: TI(德州仪器); JLCPCB Part Class: Extended Part
U8 U10 U12 U34 U37-U44 U51 U52 U56 U62 U69 U70 = CD74HCT374E: Contributor: LCSC; Supplier: LCSC; Supplier Part: C1523204; Manufacturer: TI(德州仪器); JLCPCB Part Class: Extended Part
C3 C4 = C_0603_US: Contributor: LCEDA_Lib
U2 U3 U13 U24 U45-U47 U49 U50 U54 U55 U66 U67 U71-U73 U75 = CD74HCT161E: Contributor: LCSC; Supplier: LCSC; Supplier Part: C1523314; Manufacturer: TI(德州仪器); JLCPCB Part Class: Extended Part
U6 U17 U28 U30 U57 U58 U61 U64 U65 = TLC7524CNE4: Supplier: LCSC; Supplier Part: C6554094; Manufacturer: TI(德州仪器); Contributor: lcsc; JLCPCB Part Class: Extended Part
U14 U18 = CD74HCT153E: Contributor: LCSC; Supplier: LCSC; Supplier Part: C1547108; Manufacturer: TI(德州仪器); JLCPCB Part Class: Extended Part
U4 U20 U21 U23 U48 U74 = CD74HCT00E: Contributor: LCSC; Supplier: LCSC; Supplier Part: C2861752; Manufacturer: TI(德州仪器); JLCPCB Part Class: Extended Part
U22 = CD74HC164E: Contributor: LCSC; Supplier: LCSC; Supplier Part: C2862399; Manufacturer: TI(德州仪器); JLCPCB Part Class: Extended Part
U31 = CD4070BE: Contributor: LCSC; Supplier: LCSC; Supplier Part: C910851; Manufacturer: HGSEMI(华冠); JLCPCB Part Class: Extended Part
U53 U68 = SST39SF040-70-4C-PHE_C220176: Contributor: LCSC; Supplier: LCSC; Supplier Part: C220176; Manufacturer: MICROCHIP(美国微芯); Manufacturer Part: SST39SF040-70-4C-PHE; JLCPCB Part Class: Extended Part
U7 U59 U60 U63 = BUZZER_C9900021864: Contributor: lcsc; Supplier: LCSC; Supplier Part: C9900021864; Manufacturer: null; Manufacturer Part: BUZZER; JLCPCB Part Class: Extended Part
X1-X4 = 直插有源晶振: Contributor: denjhang
U5 U15 U25-U27 U77 = CD74HCT74E: Contributor: LCSC; Supplier: LCSC; Supplier Part: C1523192; Manufacturer: TI(德州仪器); JLCPCB Part Class: Extended Part
U78 = CD74HCT04E
U19 = CD74HC4053E: Supplier: LCSC; Manufacturer: TI(德州仪器); Supplier Part: C2898; JLCPCB Part Class: Extended Part
U29 = CD74HC86EG4: Supplier: LCSC; Supplier Part: C21674017; Manufacturer: null; Contributor: lcsc

## Nets
3V3_A0: U1.3(1D) U9.8(D4)
3V3_D0: U9.12(C0) U11.3(1D)
3V3_D1: U9.13(C1) U11.4(2D)
3V3_D2: U9.14(C2) U11.7(3D)
3V3_D3: U9.15(C3) U11.8(4D)
3V3_D4: U9.16(C4) U11.13(5D)
3V3_D5: U9.17(C5) U11.14(6D)
3V3_D6: U9.18(C6) U11.17(7D)
3V3_D7: U9.19(C7) U11.18(8D)
GND: U1.1(OE#) U1.10(GND) U2.8(GND) U3.8(GND) U4.7(GND) U5.7(GND) U6.3(GND) U6.12(CS#) U6.13(WR#) U6.16(RFB) U7.1 U8.1(OE#) U8.10(GND) U9.3(GND) U9.22(GND) U10.1(OE#) U10.10(GND) U11.1(OE#) U11.10(GND) U12.1(OE#) U12.10(GND) U13.3(P0) U13.4(P1) U13.5(P2) U13.6(P3) U13.8(GND) U14.1(1E#) U14.8(GND) U15.7(GND) U16.7(GND) U17.3(GND) U17.12(CS#) U17.13(WR#) U17.16(RFB) U18.1(1E#) U18.8(GND) U19.6(E#) U19.7(VEE) U19.8(GND) U20.7(GND) U21.7(GND) U22.7(GND) U23.7(GND) U24.8(GND) U25.7(GND) U26.7(GND) U27.7(GND) U28.3(GND) U28.9(DB2) U28.10(DB1) U28.11(DB0) U28.13(WR#) U28.16(RFB) U29.7(GND) U30.3(GND) U30.8(DB3) U30.9(DB2) U30.10(DB1) U30.11(DB0) U30.13(WR#) U30.16(RFB) U31.7(VSS) U32.7(GND) U33.7(GND) U34.1(OE#) U34.10(GND) U35.7(GND) U36.7(GND) U37.1(OE#) U37.10(GND) U38.1(OE#) U38.10(GND) U39.1(OE#) U39.10(GND) U40.1(OE#) U40.10(GND) U41.1(OE#) U41.10(GND) U42.1(OE#) U42.10(GND) U43.1(OE#) U43.10(GND) U44.1(OE#) U44.10(GND) U45.8(GND) U46.8(GND) U47.8(GND) U48.7(GND) U49.8(GND) U50.8(GND) U51.1(OE#) U51.10(GND) U52.1(OE#) U52.10(GND) U53.1(A18) U53.2(A16) U53.16(VSS) U53.24(OE#) U53.30(A17) U54.3(P0) U54.4(P1) U54.5(P2) U54.6(P3) U54.8(GND) U55.3(P0) U55.4(P1) U55.5(P2) U55.6(P3) U55.8(GND) U56.1(OE#) U56.10(GND) U57.3(GND) U57.13(WR#) U57.16(RFB) U58.3(GND) U58.12(CS#) U58.13(WR#) U58.16(RFB) U59.1 U60.1 U61.3(GND) U61.12(CS#) U61.13(WR#) U61.16(RFB) U62.1(OE#) U62.10(GND) U63.1 U64.3(GND) U64.12(CS#) U64.13(WR#) U64.16(RFB) U65.3(GND) U65.13(WR#) U65.16(RFB) U66.3(P0) U66.4(P1) U66.5(P2) U66.6(P3) U66.8(GND) U67.3(P0) U67.4(P1) U67.5(P2) U67.6(P3) U67.8(GND) U68.1(A18) U68.16(VSS) U68.24(OE#) U68.30(A17) U69.1(OE#) U69.10(GND) U70.1(OE#) U70.10(GND) U71.8(GND) U72.8(GND) U73.8(GND) U74.7(GND) U75.3(P0) U75.4(P1) U75.5(P2) U75.6(P3) U75.8(GND) U76.7(GND) U77.7(GND) U78.7(GND) X1.4(GND) X1.7(GND) X2.4(GND) X2.7(GND) X3.4(GND) X3.7(GND) X4.4(GND) X4.7(GND)
VCC: U1.11(LE) U1.20(VCC) U2.7(PE) U2.10(TE) U2.16(VCC) U3.16(VCC) U4.14(VCC) U5.4(1PRE#) U5.10(2PRE#) U5.14(VCC) U6.14(VDD) U8.20(VCC) U9.2(5V) U10.20(VCC) U11.11(LE) U11.20(VCC) U12.20(VCC) U13.7(PE) U13.9(SPE#) U13.10(TE) U13.16(VCC) U14.15(2E#) U14.16(VCC) U15.4(1PRE#) U15.10(2PRE#) U15.14(VCC) U16.14(VCC) U17.14(VDD) U18.15(2E#) U18.16(VCC) U19.16(VCC) U20.14(VCC) U21.14(VCC) U22.2(DS2) U22.9(MR#) U22.14(VCC) U23.14(VCC) U24.16(VCC) U25.4(1PRE#) U25.10(2PRE#) U25.14(VCC) U26.4(1PRE#) U26.10(2PRE#) U26.14(VCC) U27.4(1PRE#) U27.10(2PRE#) U27.14(VCC) U28.14(VDD) U28.15(REF) U30.14(VDD) U30.15(REF) U31.14(VDD) U32.14(VCC) U33.14(VCC) U34.20(VCC) U35.14(VCC) U36.14(VCC) U37.20(VCC) U38.20(VCC) U39.20(VCC) U40.20(VCC) U41.20(VCC) U42.20(VCC) U43.20(VCC) U44.20(VCC) U45.16(VCC) U46.7(PE) U46.10(TE) U46.16(VCC) U47.16(VCC) U48.14(VCC) U49.7(PE) U49.10(TE) U49.16(VCC) U50.16(VCC) U51.20(VCC) U52.20(VCC) U53.31(WE#) U53.32(VDD) U54.9(SPE#) U54.16(VCC) U55.9(SPE#) U55.16(VCC) U56.20(VCC) U57.14(VDD) U57.15(REF) U58.14(VDD) U61.14(VDD) U62.20(VCC) U64.14(VDD) U65.14(VDD) U65.15(REF) U66.16(VCC) U67.16(VCC) U68.31(WE#) U68.32(VDD) U69.20(VCC) U70.20(VCC) U71.16(VCC) U72.7(PE) U72.10(TE) U72.16(VCC) U73.16(VCC) U74.14(VCC) U75.16(VCC) U76.14(VCC) U77.4(1PRE#) U77.14(VCC) U78.14(VCC) X1.14(VCC) X2.14(VCC) X3.14(VCC) X4.14(VCC)
3V3_/CS: U1.8(4D) U9.11(D7)
3V3_/RST: U1.7(3D) U9.10(D6)
3V3_/WR: U1.4(2D) U9.9(D5)
/A0: U32.4(2Y#) U33.2(1B)
/at8191: U78.4(2Y)
/at_8191: U76.13(4B)
/bind: U20.3(1Y) U20.4(2A)
/CS: U1.9(4Q) U32.1(1A)
/PE: U2.9(SPE#) U3.9(SPE#) U4.3(1Y) U19.1(B1) U23.3(1Y) U24.9(SPE#) U45.9(SPE#) U46.9(SPE#) U47.9(SPE#) U48.3(1Y) U49.9(SPE#) U50.9(SPE#) U71.9(SPE#) U72.9(SPE#) U73.9(SPE#) U74.3(1Y)
/RC: C3.2 U21.8(3Y) U21.13(4B)
/RST: U1.6(3Q) U2.1(MR#) U3.1(MR#) U5.1(1CLR#) U5.13(2CLR#) U13.1(MR#) U15.1(1CLR#) U15.13(2CLR#) U24.1(MR#) U25.1(1CLR#) U25.13(2CLR#) U26.1(1CLR#) U26.13(2CLR#) U27.1(1CLR#) U27.13(2CLR#) U45.1(MR#) U46.1(MR#) U47.1(MR#) U49.1(MR#) U50.1(MR#) U54.1(MR#) U55.1(MR#) U66.1(MR#) U67.1(MR#) U71.1(MR#) U72.1(MR#) U73.1(MR#) U75.1(MR#) U77.1(1CLR#)
/trig_clr: U66.9(SPE#) U67.9(SPE#) U75.9(SPE#) U78.2(1Y)
/WR: U1.5(2Q) U33.5(2B) U33.13(4B)
/xor_fb: U21.6(2Y) U21.12(4A)
A0: U1.2(1Q) U32.3(2A) U33.10(3B) U53.12(A0) U55.14(Q0) U66.14(Q0)
A1: U53.11(A1) U55.13(Q1) U66.13(Q1)
A2: U53.10(A2) U55.12(Q2) U66.12(Q2)
A3: U53.9(A3) U55.11(Q3) U66.11(Q3)
A4: U53.8(A4) U54.14(Q0) U67.14(Q0)
A5: U53.7(A5) U54.13(Q1) U67.13(Q1)
A6: U53.6(A6) U54.12(Q2) U67.12(Q2)
A7: U53.5(A7) U54.11(Q3) U67.11(Q3)
A8: U68.27(A8) U75.14(Q0)
A9: U68.26(A9) U75.13(Q1)
A10: U68.23(A10) U75.12(Q2)
A11: U68.25(A11) U75.11(Q3)
addr_cp: U33.6(2Y) U34.11(CP)
at_8191: U76.8(3Y) U78.3(2A)
CLK: U2.2(CP) U3.2(CP) U5.3(1CLK) U13.2(CP) U24.2(CP) U25.3(1CLK) U28.12(CS#) U30.12(CS#) U45.2(CP) U46.2(CP) U47.2(CP) U49.2(CP) U50.2(CP) U53.22(CE#) U54.2(CP) U55.2(CP) U57.12(CS#) U65.12(CS#) U66.2(CP) U67.2(CP) U68.22(CE#) U71.2(CP) U72.2(CP) U73.2(CP) U75.2(CP) X1.8(OUT) X1.11(OUT) X2.8(OUT) X2.11(OUT) X3.8(OUT) X3.11(OUT) X4.8(OUT) X4.11(OUT)
CS: U32.2(1Y#) U33.1(1A) U33.9(3A)
D0: U8.3(D0) U10.3(D0) U11.2(1Q) U12.3(D0) U34.3(D0) U37.3(D0) U38.3(D0) U39.3(D0) U40.3(D0) U41.3(D0) U42.3(D0) U43.3(D0) U44.3(D0) U51.3(D0) U52.3(D0) U56.3(D0) U62.3(D0) U69.3(D0) U70.3(D0)
D1: U8.4(D1) U10.4(D1) U11.5(2Q) U12.4(D1) U34.4(D1) U37.4(D1) U38.4(D1) U39.4(D1) U40.4(D1) U41.4(D1) U42.4(D1) U43.4(D1) U44.4(D1) U51.4(D1) U52.4(D1) U56.4(D1) U62.4(D1) U69.4(D1) U70.4(D1)
D2: U8.7(D2) U10.7(D2) U11.6(3Q) U12.7(D2) U34.7(D2) U37.7(D2) U38.7(D2) U39.7(D2) U40.7(D2) U41.7(D2) U42.7(D2) U43.7(D2) U44.7(D2) U51.7(D2) U52.7(D2) U56.7(D2) U62.7(D2) U69.7(D2) U70.7(D2)
D3: U8.8(D3) U10.8(D3) U11.9(4Q) U12.8(D3) U34.8(D3) U37.8(D3) U38.8(D3) U39.8(D3) U40.8(D3) U41.8(D3) U42.8(D3) U43.8(D3) U44.8(D3) U51.8(D3) U52.8(D3) U56.8(D3) U62.8(D3) U69.8(D3) U70.8(D3)
D4: U8.13(D4) U10.13(D4) U11.12(5Q) U12.13(D4) U34.13(D4) U37.13(D4) U38.13(D4) U39.13(D4) U40.13(D4) U41.13(D4) U42.13(D4) U43.13(D4) U44.13(D4) U51.13(D4) U52.13(D4) U56.13(D4) U62.13(D4) U69.13(D4) U70.13(D4)
D5: U8.14(D5) U10.14(D5) U11.15(6Q) U12.14(D5) U34.14(D5) U37.14(D5) U38.14(D5) U39.14(D5) U40.14(D5) U41.14(D5) U42.14(D5) U43.14(D5) U44.14(D5) U51.14(D5) U52.14(D5) U56.14(D5) U62.14(D5) U69.14(D5) U70.14(D5)
D6: U8.17(D6) U10.17(D6) U11.16(7Q) U12.17(D6) U34.17(D6) U37.17(D6) U38.17(D6) U39.17(D6) U40.17(D6) U41.17(D6) U42.17(D6) U43.17(D6) U44.17(D6) U51.17(D6) U52.17(D6) U56.17(D6) U62.17(D6) U69.17(D6) U70.17(D6)
D7: U8.18(D7) U10.18(D7) U11.19(8Q) U12.18(D7) U34.18(D7) U37.18(D7) U38.18(D7) U39.18(D7) U40.18(D7) U41.18(D7) U42.18(D7) U43.18(D7) U44.18(D7) U51.18(D7) U52.18(D7) U56.18(D7) U62.18(D7) U69.18(D7) U70.18(D7)
DAC-b0: U29.3(1Y) U30.7(DB4) U53.13(DQ0) U57.11(DB0) U65.11(DB0) U68.13(DQ0)
DAC-b1: U29.6(2Y) U30.6(DB5) U53.14(DQ1) U57.10(DB1) U65.10(DB1) U68.14(DQ1)
DAC-b2: U29.8(3Y) U30.5(DB6) U53.15(DQ2) U57.9(DB2) U65.9(DB2) U68.15(DQ2)
DAC-b3: U29.11(4Y) U30.4(DB7) U53.17(DQ3) U57.8(DB3) U65.8(DB3) U68.17(DQ3)
DAC-b4: U53.18(DQ4) U57.7(DB4) U65.7(DB4) U68.18(DQ4)
DAC-b5: U53.19(DQ5) U57.6(DB5) U65.6(DB5) U68.19(DQ5)
DAC-b6: U53.20(DQ6) U57.5(DB6) U65.5(DB6) U68.20(DQ6)
DAC-b7: U53.21(DQ7) U57.4(DB7) U65.4(DB7) U68.21(DQ7)
data_strobe: U33.11(4Y) U35.2(1B) U35.5(2B) U35.9(3A) U35.12(4A) U36.2(1B) U36.5(2B) U36.9(3A) U36.12(4A)
duty_25: U14.4(1I2) U16.3(1Y) U16.10(3B)
duty_125: U14.5(1I1) U16.8(3Y)
duty_625: U14.6(1I0) U16.6(2Y)
DUTY_D0: U10.12(Q4) U14.2(S1) U39.12(Q4)
DUTY_D1: U10.15(Q5) U14.14(S0) U39.15(Q5)
freq_tc: U76.12(4A)
HC164_Q4: U22.3(Q0) U31.6(D)
HC164_Q5: U22.5(Q2) U31.5(C)
HC164_Q6: U22.12(Q6) U31.2(B)
HC164_Q7: U17.15(REF) U22.13(Q7) U31.1(A)
n_ind: U20.6(2Y) U20.12(4A)
N_Start: U21.11(4Y)
n_tc: U20.8(3Y) U20.13(4B)
NOISE/2: U13.14(Q0) U18.6(1I0)
NOISE/4: U13.13(Q1) U18.5(1I1)
NOISE/8: U13.12(Q2) U18.4(1I2)
NOISE/16: U13.11(Q3) U18.3(1I3)
noise_clk: U20.11(4Y) U22.8(CP)
NOISE_D0: U12.2(Q0) U17.7(DB4) U17.8(DB3) U17.9(DB2) U17.10(DB1) U17.11(DB0) U37.2(Q0)
NOISE_D1: U12.5(Q1) U17.6(DB5) U37.5(Q1)
NOISE_D2: U12.6(Q2) U17.5(DB6) U37.6(Q2)
NOISE_D3: U12.9(Q3) U17.4(DB7) U37.9(Q3)
NOISE_D4: U12.12(Q4) U18.2(S1) U37.12(Q4)
NOISE_D5: U12.15(Q5) U18.14(S0) U37.15(Q5)
NOISE_D6: U12.16(Q6) U20.1(1A) U20.2(1B) U20.10(3B) U37.16(Q6)
NOISE_D7: U12.19(Q7) U37.19(Q7)
noise_ind_clk: U18.7(1Y) U20.5(2B)
NOISE_OUT: U17.1(OUT1)
PSG_A0: U34.2(Q0) U35.1(1A)
PSG_A1: U34.5(Q1) U35.4(2A)
PSG_A2: U34.6(Q2) U35.10(3B)
PSG_A3: U34.9(Q3) U35.13(4B)
PSG_A4: U34.12(Q4) U36.1(1A)
PSG_A5: U34.15(Q5) U36.4(2A)
PSG_A6: U34.16(Q6) U36.10(3B)
PSG_A7: U34.19(Q7) U36.13(4B)
PSG_OUT: U6.1(OUT1) U7.2(+)
Q0: U2.3(P0) U8.2(Q0) U38.2(Q0)
Q1: U2.4(P1) U8.5(Q1) U38.5(Q1)
Q2: U2.5(P2) U8.6(Q2) U38.6(Q2)
Q3: U2.6(P3) U8.9(Q3) U38.9(Q3)
Q4: U3.3(P0) U8.12(Q4) U38.12(Q4)
Q5: U3.4(P1) U8.15(Q5) U38.15(Q5)
Q6: U3.5(P2) U8.16(Q6) U38.16(Q6)
Q7: U3.6(P3) U8.19(Q7) U38.19(Q7)
RC1: C3.1 C4.1 U21.10(3B)
RC2: C4.2 U21.9(3A)
reg5_q0: U42.2(Q0) U53.27(A8) U56.2(Q0) U62.2(Q0) U68.28(A13)
reg5_q1: U42.5(Q1) U53.26(A9) U56.5(Q1) U62.5(Q1) U68.29(A14)
reg5_q2: U42.6(Q2) U53.23(A10) U56.6(Q2) U62.6(Q2) U68.3(A15)
reg5_q3: U42.9(Q3) U53.25(A11) U56.9(Q3) U62.9(Q3) U68.2(A16)
reg5_q4: U42.12(Q4) U53.4(A12) U56.12(Q4)
reg5_q5: U42.15(Q5) U53.28(A13) U56.15(Q5)
reg5_q6: U42.16(Q6) U53.29(A14) U56.16(Q6) U62.16(Q6)
reg5_q6_trig: U76.4(2A)
reg5_q7: U42.19(Q7) U53.3(A15) U56.19(Q7) U62.19(Q7)
reg5_q7_mode: U76.2(1B) U76.5(2B)
reg_cp[0: U8.11(CP) U35.3(1Y) U38.11(CP)
reg_cp[1: U10.11(CP) U35.6(2Y) U39.11(CP)
reg_cp[2: U12.11(CP) U35.8(3Y) U37.11(CP)
reg_cp[3: U35.11(4Y) U40.11(CP) U44.11(CP) U51.11(CP) U70.11(CP)
reg_cp[4: U36.3(1Y) U41.11(CP) U43.11(CP) U52.11(CP) U69.11(CP)
reg_cp[5: U36.6(2Y) U42.11(CP) U56.11(CP) U62.11(CP)
reg_cp[6: U36.8(3Y)
reg_cp[7: U36.11(4Y)
reload_pulse: U5.5(1Q) U5.11(2CLK) U25.5(1Q) U25.11(2CLK)
ROM-A0: U68.12(A0)
ROM-A1: U68.11(A1)
ROM-A2: U68.10(A2)
ROM-A3: U68.9(A3)
ROM-A4: U68.8(A4)
ROM-A5: U68.7(A5)
ROM-A6: U68.6(A6)
ROM-A7: U68.5(A7)
ROM-A12: U68.4(A12) U76.10(3B) U77.5(1Q)
rom_tc_hi: U54.7(PE) U54.10(TE) U55.15(TC)
SQR/NOISE: U10.16(Q6) U19.11(S0) U39.16(Q6)
sqr_out: U14.7(1Y) U19.12(A0)
SQR_REF_IN: U6.15(REF) U19.14(AN)
step: U76.11(4Y)
t1: U33.3(1Y) U33.4(2A)
t2: U33.8(3Y) U33.12(4A)
tc_a03: U66.15(TC) U67.7(PE) U67.10(TE)
tc_a47: U67.15(TC) U76.1(1A)
tc_a811: U75.15(TC) U76.9(3A) U77.3(1CLK)
tc_hi: U3.15(TC) U4.1(1A) U4.2(1B) U19.2(B0) U21.1(1A) U21.2(1B) U23.1(1A) U23.2(1B) U24.15(TC) U25.2(1D) U47.15(TC) U48.1(1A) U48.2(1B) U55.7(PE) U55.10(TE) U66.7(PE) U66.10(TE) U73.15(TC) U74.1(1A) U74.2(1B)
tc_hi_1D: U5.2(1D) U19.15(BN)
tc_hi_bind: U20.9(3A) U21.3(1Y)
tc_lo: U2.15(TC) U3.7(PE) U3.10(TE) U45.7(PE) U45.10(TE) U46.15(TC) U49.15(TC) U50.7(PE) U50.10(TE) U71.7(PE) U71.10(TE) U72.15(TC)
tc_mi: U24.7(PE) U24.10(TE) U45.15(TC) U47.7(PE) U47.10(TE) U50.15(TC) U71.15(TC) U73.7(PE) U73.10(TE)
tc_pcm: U75.7(PE) U75.10(TE) U76.3(1Y)
toggle_q: U5.9(2Q) U14.3(1I3) U15.3(1CLK) U16.1(1A)
toggle_q/2: U15.5(1Q) U15.11(2CLK) U16.2(1B) U16.4(2A)
toggle_q/4: U15.9(2Q) U16.5(2B) U16.9(3A)
toggle_q_wave: U25.9(2Q) U26.3(1CLK) U28.8(DB3) U29.1(1A)
trig_clr: U76.6(2Y) U78.1(1A)
VOL_Q0: U6.7(DB4) U6.8(DB3) U6.9(DB2) U6.10(DB1) U6.11(DB0) U10.2(Q0) U39.2(Q0)
VOL_Q1: U6.6(DB5) U10.5(Q1) U39.5(Q1)
VOL_Q2: U6.5(DB6) U10.6(Q2) U39.6(Q2)
VOL_Q3: U6.4(DB7) U10.9(Q3) U39.9(Q3)
w/2: U26.5(1Q) U26.11(2CLK) U28.7(DB4) U29.4(2A)
w/4: U26.9(2Q) U27.3(1CLK) U28.6(DB5) U29.9(3A)
w/8: U27.5(1Q) U27.11(2CLK) U28.5(DB6) U29.12(4A)
w/16: U27.9(2Q) U28.4(DB7) U29.2(1B) U29.5(2B) U29.10(3B) U29.13(4B)
WAVE: U3.13(Q1) U19.13(A1)
wave-p0: U40.2(Q0) U44.2(Q0) U46.3(P0) U49.3(P0) U51.2(Q0) U70.2(Q0) U72.3(P0)
wave-p1: U40.5(Q1) U44.5(Q1) U46.4(P1) U49.4(P1) U51.5(Q1) U70.5(Q1) U72.4(P1)
wave-p2: U40.6(Q2) U44.6(Q2) U46.5(P2) U49.5(P2) U51.6(Q2) U70.6(Q2) U72.5(P2)
wave-p3: U40.9(Q3) U44.9(Q3) U46.6(P3) U49.6(P3) U51.9(Q3) U70.9(Q3) U72.6(P3)
wave-p4: U40.12(Q4) U44.12(Q4) U45.3(P0) U50.3(P0) U51.12(Q4) U70.12(Q4) U71.3(P0)
wave-p5: U40.15(Q5) U44.15(Q5) U45.4(P1) U50.4(P1) U51.15(Q5) U70.15(Q5) U71.4(P1)
wave-p6: U40.16(Q6) U44.16(Q6) U45.5(P2) U50.5(P2) U51.16(Q6) U70.16(Q6) U71.5(P2)
wave-p7: U40.19(Q7) U44.19(Q7) U45.6(P3) U50.6(P3) U51.19(Q7) U70.19(Q7) U71.6(P3)
wave-p8: U24.3(P0) U41.12(Q4) U43.12(Q4) U47.3(P0) U52.12(Q4) U69.12(Q4) U73.3(P0)
wave-p9: U24.4(P1) U41.15(Q5) U43.15(Q5) U47.4(P1) U52.15(Q5) U69.15(Q5) U73.4(P1)
wave-p10: U24.5(P2) U41.16(Q6) U43.16(Q6) U47.5(P2) U52.16(Q6) U69.16(Q6) U73.5(P2)
wave-p11: U24.6(P3) U41.19(Q7) U43.19(Q7) U47.6(P3) U52.19(Q7) U69.19(Q7) U73.6(P3)
wave-vol0: U41.2(Q0) U43.2(Q0) U52.2(Q0) U58.7(DB4) U58.8(DB3) U58.9(DB2) U58.10(DB1) U58.11(DB0) U61.7(DB4) U61.8(DB3) U61.9(DB2) U61.10(DB1) U61.11(DB0) U64.7(DB4) U64.8(DB3) U64.9(DB2) U64.10(DB1) U64.11(DB0) U69.2(Q0)
wave-vol1: U41.5(Q1) U43.5(Q1) U52.5(Q1) U58.6(DB5) U61.6(DB5) U64.6(DB5) U69.5(Q1)
wave-vol2: U41.6(Q2) U43.6(Q2) U52.6(Q2) U58.5(DB6) U61.5(DB6) U64.5(DB6) U69.6(Q2)
wave-vol3: U41.9(Q3) U43.9(Q3) U52.9(Q3) U58.4(DB7) U61.4(DB7) U64.4(DB7) U69.9(Q3)
WAVE_OUT: U58.1(OUT1) U59.2(+) U60.2(+) U61.1(OUT1) U63.2(+) U64.1(OUT1)
WAVE_REF_IN: U28.1(OUT1) U30.1(OUT1) U57.1(OUT1) U58.15(REF) U61.15(REF) U64.15(REF) U65.1(OUT1)
WAVE_SEL: U10.19(Q7) U19.9(S2) U39.19(Q7)
xor_a: U31.3(J=A⊕B) U31.8(E)
xor_b: U31.4(K=C⊕D) U31.9(F)
xor_fb: U21.4(2A) U21.5(2B) U22.1(DS1) U31.10(L=E⊕F)
Net-(U5-8): U5.8(2Q#) U5.12(2D)
Net-(U15-2): U15.2(1D) U15.6(1Q#)
Net-(U15-8): U15.8(2Q#) U15.12(2D)
Net-(U25-8): U25.8(2Q#) U25.12(2D)
Net-(U26-2): U26.2(1D) U26.6(1Q#)
Net-(U26-8): U26.8(2Q#) U26.12(2D)
Net-(U27-2): U27.2(1D) U27.6(1Q#)
Net-(U27-8): U27.8(2Q#) U27.12(2D)
Net-(U77-2): U77.2(1D) U77.6(1Q#)

Not connected (* = marked no-connect by the designer): U1 12(5Q)* 13(5D)* 14(6D)* 15(6Q)* 16(7Q)* 17(7D)* 18(8D)* 19(8Q)*; U2 11(Q3)* 12(Q2)* 13(Q1)* 14(Q0)*; U3 11(Q3)* 12(Q2)* 14(Q0)*; U4 4(2A)* 5(2B)* 6(2Y)* 8(3Y)* 9(3A)* 10(3B)* 11(4Y)* 12(4A)* 13(4B)*; U5 6(1Q#)*; U6 2(OUT2)*; U9 1(3V)* 4(D0)* 5(D1)* 6(D2)* 7(D3)* 20(C8)* 21(C9)*; U13 15(TC)*; U14 9(2Y)* 10(2I0)* 11(2I1)* 12(2I2)* 13(2I3)*; U16 11(4Y)* 12(4A)* 13(4B)*; U17 2(OUT2)*; U18 9(2Y)* 10(2I0)* 11(2I1)* 12(2I2)* 13(2I3)*; U19 3(C1)* 4(CN)* 5(C0)* 10(S1)*; U22 4(Q1)* 6(Q3)* 10(Q4) 11(Q5); U23 4(2A)* 5(2B)* 6(2Y)* 8(3Y)* 9(3A)* 10(3B)* 11(4Y)* 12(4A)* 13(4B)*; U24 11(Q3)* 12(Q2)* 13(Q1)* 14(Q0)*; U25 6(1Q#)*; U28 2(OUT2)*; U29 14(VCC); U30 2(OUT2)*; U31 11(M=G⊕H)* 12(G)* 13(H)*; U32 5(3A)* 6(3Y#)* 8(4Y#)* 9(4A)* 10(5Y#)* 11(5A)* 12(6Y#)* 13(6A)*; U45 11(Q3)* 12(Q2)* 13(Q1)* 14(Q0)*; U46 11(Q3)* 12(Q2)* 13(Q1)* 14(Q0)*; U47 11(Q3)* 12(Q2)* 13(Q1)* 14(Q0)*; U48 4(2A)* 5(2B)* 6(2Y)* 8(3Y)* 9(3A)* 10(3B)* 11(4Y)* 12(4A)* 13(4B)*; U49 11(Q3)* 12(Q2)* 13(Q1)* 14(Q0)*; U50 11(Q3)* 12(Q2)* 13(Q1)* 14(Q0)*; U54 15(TC)*; U57 2(OUT2)*; U58 2(OUT2)*; U61 2(OUT2)*; U62 12(Q4)* 15(Q5)*; U64 2(OUT2)*; U65 2(OUT2)*; U71 11(Q3)* 12(Q2)* 13(Q1)* 14(Q0)*; U72 11(Q3)* 12(Q2)* 13(Q1)* 14(Q0)*; U73 11(Q3)* 12(Q2)* 13(Q1)* 14(Q0)*; U74 4(2A)* 5(2B)* 6(2Y)* 8(3Y)* 9(3A)* 10(3B)* 11(4Y)* 12(4A)* 13(4B)*; U77 8(2Q#)* 9(2Q)* 10(2PRE#)* 11(2CLK)* 12(2D)* 13(2CLR#)*; U78 5(3A)* 6(3Y)* 8(4Y)* 9(4A)* 10(5Y)* 11(5A)* 12(6Y)* 13(6A)*; X1 1(NC)* 2(X)* 3(X)* 5(X)* 6(X)* 9(X)* 10(X)* 12(X)* 13(X)*; X2 1(NC)* 2(X)* 3(X)* 5(X)* 6(X)* 9(X)* 10(X)* 12(X)* 13(X)*; X3 1(NC)* 2(X)* 3(X)* 5(X)* 6(X)* 9(X)* 10(X)* 12(X)* 13(X)*; X4 1(NC)* 2(X)* 3(X)* 5(X)* 6(X)* 9(X)* 10(X)* 12(X)* 13(X)*

## Notes on the sheets
sheet 1
- 上位机
- 控制信号转换
- 注意ft232h的gpio是3v3电平，很多老74带不动
- 可用LS373做总线缓冲，3V3转5V，单向
- mpsse模式不要用d1，d2
- 控制信号反相
- 数据总线转换
- AND运算 addr_cp + data_strobe
- 可用LS373做总线缓冲，3V3转5V，单向
- 发现音量高位无效的元凶，之前接错了D3和Q3
- 当然，下次可能做3bit音量
- 注意，v0.4开始做地址复用数据总线，
- 地址锁存
- AND运算 reg_cp[0-3]
- AND运算 reg_cp[4-7]
- led放这里可以 PSG_A1
- 脑洞大开，添加方波/噪音切换，音色切换
sheet 2
- 方波频率锁存
- 噪音参数锁存
- 波形通道-频率0-7
- 波形通道-频率8-11
- 音量/占空比锁存
- 脑洞大开，添加方波/噪音切换，音色切换
- 波形通道-音色
- 等波形通道验证完成之后
- 准备再加一个方波，用完剩下两个寄存器
- 用好方波的预分频，准备搞64k和128k两个方波预分频频率档位
- 删除占空比切换，节省规模
- 删除方波的噪音模式，由于不可调频率，因此没什么用
- 4bit音量，2bit预分频切换音区（从7474选），2bit波形（Q0/1选）
- 音区为进入161的clk，分别给32 64 128 256khz四档
- 还有一个思路，保留噪音绑定模式，和方波合二为一，省一个噪音寄存器
- 最后一个寄存器存8bit频率，音量和某方波可切换，音区共用
- 打算删除噪音的绑定模式，因为会干扰方波，
- 或者给161搞预置，取/4,/8,/16,/32
- 新增一个7474噪音分频选择。
- 或者给2bit噪音频率放161可调整。
- 到时候正好4bit音量，2bit分频，2bit频率
- 最后决定每个通道解除耦合
- 0/1 方波 8bit音高 4bit音量 2bit音区 2bit音色
- 2 噪音 4bit音量 2bit音区 2bit音高
- 3/4/5 波形通道 12bit音高 4bit音量 4bit占空比 1bit调制模式 2bit音色 1bit空闲
- 6/7 方波/三角/锯齿波/简化波形通道 12bit音高 4bit音量
sheet 3
- 方波频率锁存
- 方波修正
- 必须原装HCT74
- 国产HC74性能差
- 非门
- 分频
- 如果让Q3/2/1/0或者其他做非门，然后给1D，可能产生其他噪音效果
- 头脑风暴
- Q0听起来像带高频泛音的喇叭音
- Q1听起来像二胡音
- Q2在c5无声，在c4像带占空比的方波
- Q3在c4无声
- 7524的REF接TE，出小声高音萨克斯音
- 7524的REF接/PE，出小声萨克斯音
- 64khz
- 音高都比方波高一个八度
- 脑洞大开，7474的1D接/PE能产生白噪
- 但是1D接Q3/2/1/0不能得到频率正常的方波
sheet 4
- 音量/占空比锁存
- 方波占空比 4选1
- 噪音/方波 bit6 2选1 方波或噪音
- 波形切换 bit7 2选1 方波或161-Q0
- 1D接/PE即可获得白噪音频率和总频率有关系
- 脑洞大开，添加方波/噪音切换，音色切换
- 方波2/4分频
- 2026.6.30
- R2R音量调节
- REF输入端
- 1.此架构发现bug，最多只能扫4个八度
- 后更换原装74HCT74正常
- 2026.7.1
- 1.新增音量控制
- 2026.7.2
- 1.新增373数据总线缓冲器，
  考虑总线上负载越来越多
- 接7654或者7420，其他位填充GND
- 加噪音之后，这里也不能用国产74hc74
- 2.新增方波2bit占空比选择，加分频器获得
- AND运算生成占空比
- 3.新增白噪音，1D接/PE即可获得
- 4.头脑风暴，发现161高位输出接7524的REF获得免费音色扩充，据说是乘法调制
- 实测发现这个功能相当完美。
- 占空比能控制这里的噪音频率，但是基本上就50方波产生的噪音有实用性
- 波形切换正常，占空比切换正常。
- A0寄存器表：
- bit0-3: 音量 (16 级, Q0-Q3 → DB4-7, 与 v0.2 一致)
  bit4-5: 占空比挡 (00=50% / 01=25% / 10=12.5% / 11=25%@f/4变体)
  bit6:   mode (0=方波, 1=白噪)  ← HC4053 开关 X
  bit7:   REF 选择 (0=toggle 纯净方波, 1=Q0 乘法调制)  ← HC4053
sheet 5
- 噪音参数锁存
- 噪音分频
- 噪音频率 4选1
- 非门
- noise_clk = bind ? square_tc : ind_clk
- 绑定模式tc_hi过反相器，不干扰方波
- A1寄存器表：噪音专属
- LFSR 主体 8位串入并出移位寄存器
- bit0-3: 音量 (16 级, Q0-Q3 → DB4-7)
  bit4-5: 频率挡 (00=÷2 / 01=÷4 / 10=÷8 / 11=÷16, 仅独立模式)
  bit6:   绑定方波频率开关 (0=独立分频 / 1=直通 square_tc)
  bit7:   预留
- R2R音量调节
- REF输入端
- 国产 HC164在绑定模式频率更宽，200hz也有实用性。
- 噪音反馈/启动
- 接7654或者7420，其他位填充GND
- 2026.7.6
- 实测大概率锁死无声，即使有声音也是带占空比的方波，因此放弃此方案，选择研究SQ Voice方波的噪音方法
- 非门 噪音启动
- 与其折腾这个，不如搞12位频率计数器
- 手上164是国产的，可能性能不足，不如使用原装ls374做
- 2026.7.7
- 不要共用hc00，会干扰方波
- 加张弛振荡器启动电路之后164也正常，国产164性能也够。
- hc00去掉之后暂时用104接fb和start
- 发现164在绑定模式噪音频率更宽，200hz到16000hz也能用
- 张弛振荡器 注入模拟噪音源
- 彻底防止LFSR收敛归零锁死
sheet 6
- 波形通道-频率0-7
- 分频
- 方波修正
- 方波分频
- 必须原装HCT74
- 必须原装HCT74
- 国产HC74性能差
- 国产HC74性能差
- 方波分频
- 波形通道-频率8-11
- 必须原装HCT74
- 国产HC74性能差
- R2R-DAC
- REF输入端
- 8m
- 这个三角波不够标准
- 以此为基础，加个39010即可变波形内存或者pcm
- 初步成功，搞了个5bit锯齿波
- R2R音量调节
- REF输入端
- 非门 生成/PE
- R2R-DAC
- REF输入端
- 接7654或者7420，其他位填充GND
- 三角波实验
sheet 7
- 波形通道-频率0-7
- 分频
- ROM地址计数
- 波形ROM 用64k 存256个波形
- 波形通道-频率8-11
- R2R-DAC
- REF输入端
- 波形通道-音色
- 三角波实验
- R2R音量调节
- REF输入端
- 非门 生成/PE
- 接7654或者7420，其他位填充GND
- 4m
sheet 8
- 波形通道-频率0-7
- 分频
- Wave地址计数 a0-a7
- PCM地址计数 a8-a11
- 波形ROM 用64k 存256个波形
- 波形通道-频率8-11
- A12 toggle
- R2R-DAC
- REF输入端
- 波形通道-音色
- 必须原装HCT74
- 国产HC74性能差
- AND运算生成占空比
- 4m
- 三角波实验
- R2R音量调节
- REF输入端
- 非门 生成/PE
- 非门
- 接7654或者7420，其他位填充GND
- reg3 (0x08): period12[7:0]   (两模式共用, 步进速度 = 音高/回放速度)
  reg4 (0x10): period12[11:8]<<4 | vol[3:0]  (两模式共用)
  reg5 (0x20):
    bit7: mode (0=波形, 1=采样)
    bit6: loop (采样模式: 0=单次播完停, 1=首尾循环; 波形模式不用)
    bit5-3: sel[2:0] (选 8 波形 / 8 采样, 两模式共用)
    bit2-0: 预留
